# EAGLE design Alves_ADC v.1.0 (EAGLE 9.2.2)

## Sheet 1 of 6
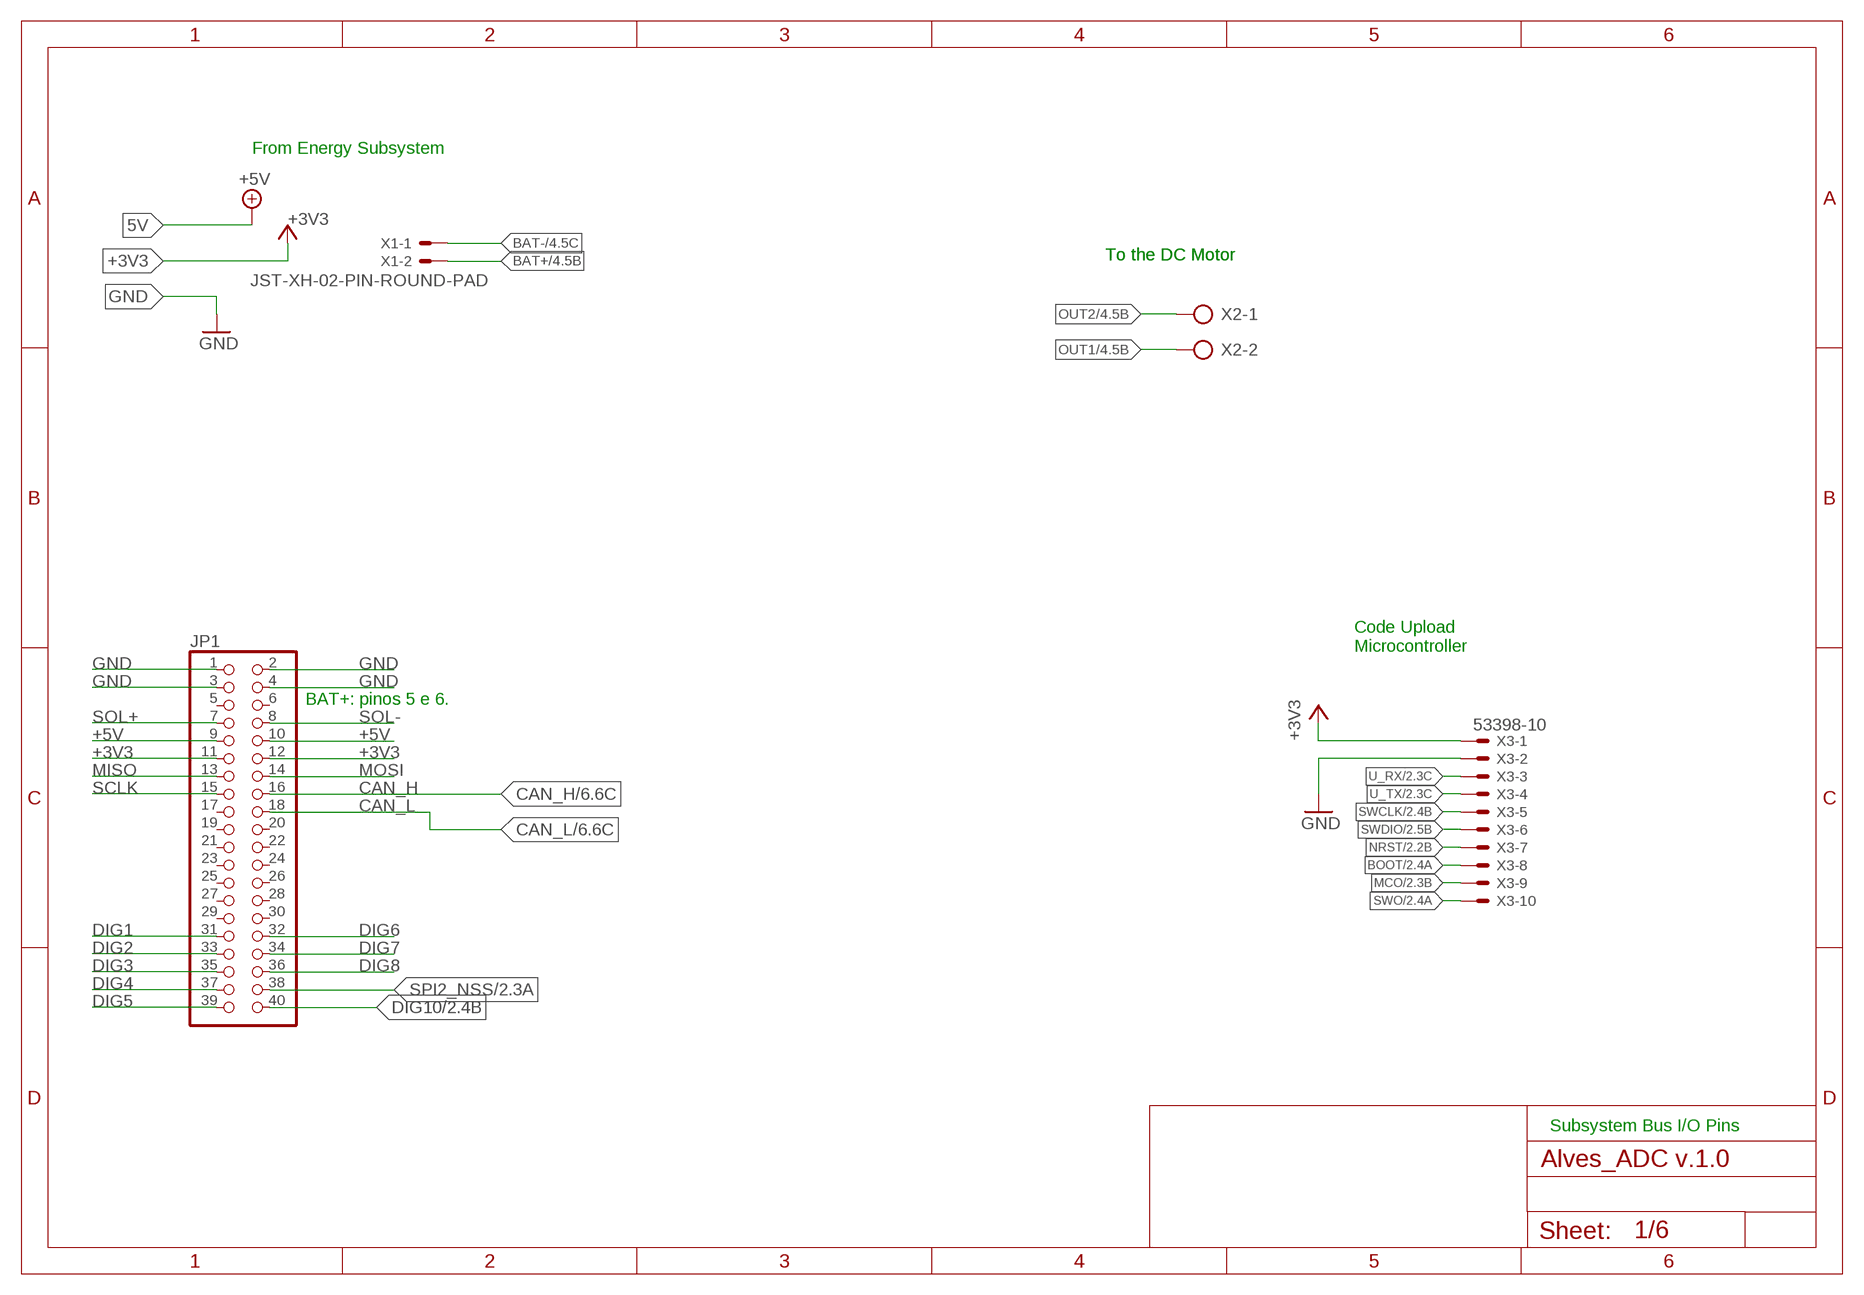
[diagram p0: schematic, sheet 1]

### Parts
JP1  PINHD-2X20  [2X20]
X1  JST-XH-02-PIN-ROUND-PAD  [JST-XH-02-PACKAGE-ROUND-PAD]
X2  AK500/2  [AK500/2]
X3  53398-10  [53398-10]

### Nets
+3V3: JP1.11 JP1.12 X3.1 ; also sheet 2,3,5,6
+5V: JP1.9 JP1.10 ; also sheet 4
BAT+: X1.2 ; also sheet 4
BAT-: X1.1 ; also sheet 4
BOOT: X3.8 ; also sheet 2
CAN_H: JP1.16 ; also sheet 6
CAN_L: JP1.18 ; also sheet 6
DIG1: JP1.31
DIG2: JP1.33
DIG3: JP1.35
DIG4: JP1.37
DIG5: JP1.39
DIG6: JP1.32
DIG7: JP1.34
DIG8: JP1.36
DIG10: JP1.40 ; also sheet 2
GND: JP1.1 JP1.2 JP1.3 JP1.4 X3.2 ; also sheet 2,3,4,5,6
MCO: X3.9 ; also sheet 2
MISO: JP1.13 ; also sheet 2
MOSI: JP1.14 ; also sheet 2
NRST: X3.7 ; also sheet 2
OUT1: X2.2 ; also sheet 4
OUT2: X2.1 ; also sheet 4
SCLK: JP1.15 ; also sheet 2
SOL+: JP1.7
SOL-: JP1.8
SPI2_NSS: JP1.38 ; also sheet 2
SWCLK: X3.5 ; also sheet 2
SWDIO: X3.6 ; also sheet 2
SWO: X3.10 ; also sheet 2
U_RX: X3.3 ; also sheet 2
U_TX: X3.4 ; also sheet 2
Unconnected: JP1.5 JP1.6 JP1.17 JP1.19 JP1.20 JP1.21 JP1.22 JP1.23 JP1.24 JP1.25 JP1.26 JP1.27 JP1.28 JP1.29 JP1.30

### Notes on the sheet
- From Energy Subsystem
- To the DC Motor | To the DC Motor
- Code Upload
  Microcontroller
- BAT+: pinos 5 e 6.
- Subsystem Bus I/O Pins

## Sheet 2 of 6
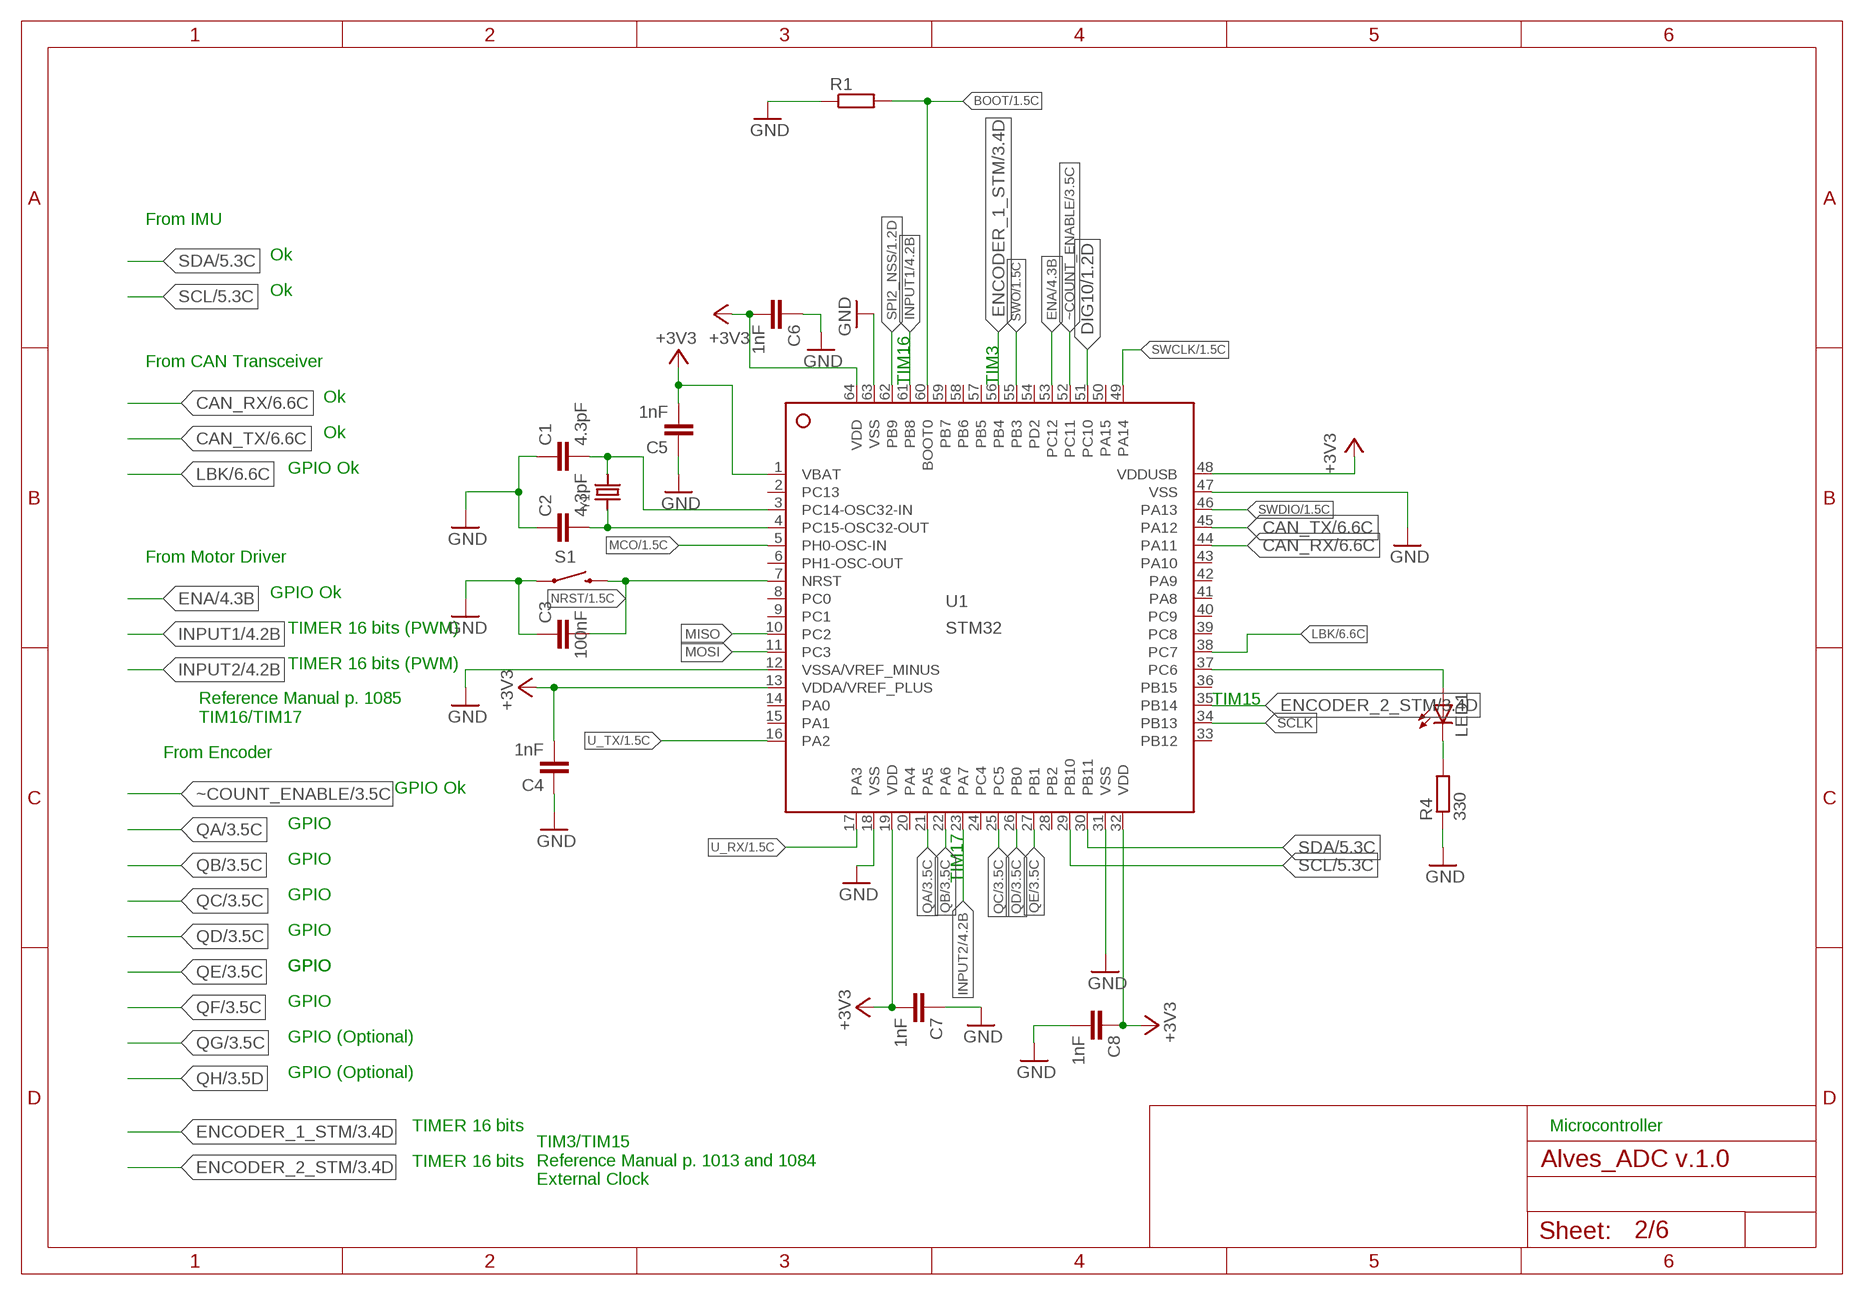
[diagram p1: schematic, sheet 2]

### Parts
C1  4.3pF  C-EUC1206  [C1206]
C2  4.3pF  C-EUC1206  [C1206]
C3  100nF  C-EUC1206  [C1206]
C4  1nF  C-EUC1206  [C1206]
C5  1nF  C-EUC1206  [C1206]
C6  1nF  C-EUC1206  [C1206]
C7  1nF  C-EUC1206  [C1206]
C8  1nF  C-EUC1206  [C1206]
LED1  LEDSMT1206  [1206]
R1  R-EU_R1206  [R1206]
R4  330  R-EU_R1206  [R1206]
S1  SWITCH-MOMENTARY-2SMD-1101NE  [TACTILE-SWITCH-1101NE]
U1  STM32  STM32L476RCT6  [LQFP64_10X10]
Y1  CRYSTAL8X3.8SMT  [CRYSTAL_8X3.8]

### Nets
+3V3: C4.2 C5.2 C6.2 C7.2 C8.1 U1.1(VBAT) U1.13(VDDA/VREF_PLUS) U1.19(VDD) U1.32(VDD) U1.48(VDDUSB) U1.64(VDD) ; also sheet 1,3,5,6
BOOT: R1.2 U1.60(BOOT0) ; also sheet 1
CAN_RX: U1.44(PA11) ; also sheet 6
CAN_TX: U1.45(PA12) ; also sheet 6
DIG10: U1.51(PC10) ; also sheet 1
ENA: U1.53(PC12) ; also sheet 4
ENCODER_1_STM: U1.56(PB4) ; also sheet 3
ENCODER_2_STM: U1.35(PB14) ; also sheet 3
GND: C1.1 C2.1 C3.1 C4.1 C5.1 C6.1 C7.1 C8.2 R1.1 R4.1 S1.1 U1.12(VSSA/VREF_MINUS) U1.18(VSS) U1.31(VSS) U1.47(VSS) U1.63(VSS) ; also sheet 1,3,4,5,6
INPUT1: U1.61(PB8) ; also sheet 4
INPUT2: U1.23(PA7) ; also sheet 4
LBK: U1.38(PC7) ; also sheet 6
MCO: U1.5(PH0-OSC-IN) ; also sheet 1
MISO: U1.10(PC2) ; also sheet 1
MOSI: U1.11(PC3) ; also sheet 1
N$1: LED1.A U1.37(PC6)
N$3: C1.2 U1.3(PC14-OSC32-IN) Y1.P$4
N$8: C2.2 U1.4(PC15-OSC32-OUT) Y1.P$1
N$10: LED1.C R4.2
NRST: C3.2 S1.2 U1.7(NRST) ; also sheet 1
QA: U1.21(PA5) ; also sheet 3
QB: U1.22(PA6) ; also sheet 3
QC: U1.25(PC5) ; also sheet 3
QD: U1.26(PB0) ; also sheet 3
QE: U1.27(PB1) ; also sheet 3
SCL: U1.29(PB10) ; also sheet 5
SCLK: U1.34(PB13) ; also sheet 1
SDA: U1.30(PB11) ; also sheet 5
SPI2_NSS: U1.62(PB9) ; also sheet 1
SWCLK: U1.49(PA14) ; also sheet 1
SWDIO: U1.46(PA13) ; also sheet 1
SWO: U1.55(PB3) ; also sheet 1
U_RX: U1.17(PA3) ; also sheet 1
U_TX: U1.16(PA2) ; also sheet 1
~COUNT_ENABLE: U1.52(PC11) ; also sheet 3
Unconnected: U1.2(PC13) U1.6(PH1-OSC-OUT) U1.8(PC0) U1.9(PC1) U1.14(PA0) U1.15(PA1) U1.20(PA4) U1.24(PC4) U1.28(PB2) U1.33(PB12) U1.36(PB15) U1.39(PC8) U1.40(PC9) U1.41(PA8) U1.42(PA9) U1.43(PA10) U1.50(PA15) U1.54(PD2) U1.57(PB5) U1.58(PB6) U1.59(PB7)

### Notes on the sheet
- From IMU
- Ok
- Ok
- From CAN Transceiver
- TIM16 | TIM3
- Ok
- Ok
- GPIO Ok
- From Motor Driver
- GPIO Ok
- TIMER 16 bits (PWM)
- TIMER 16 bits (PWM)
- TIM15
- Reference Manual p. 1085
  TIM16/TIM17
- From Encoder
- GPIO Ok
- GPIO
- GPIO
- TIM17
- GPIO
- GPIO
- GPIO | GPIO
- GPIO
- GPIO (Optional)
- GPIO (Optional)
- TIMER 16 bits | Microcontroller
- TIMER 16 bits
- TIM3/TIM15
  Reference Manual p. 1013 and 1084
  External Clock

## Sheet 3 of 6
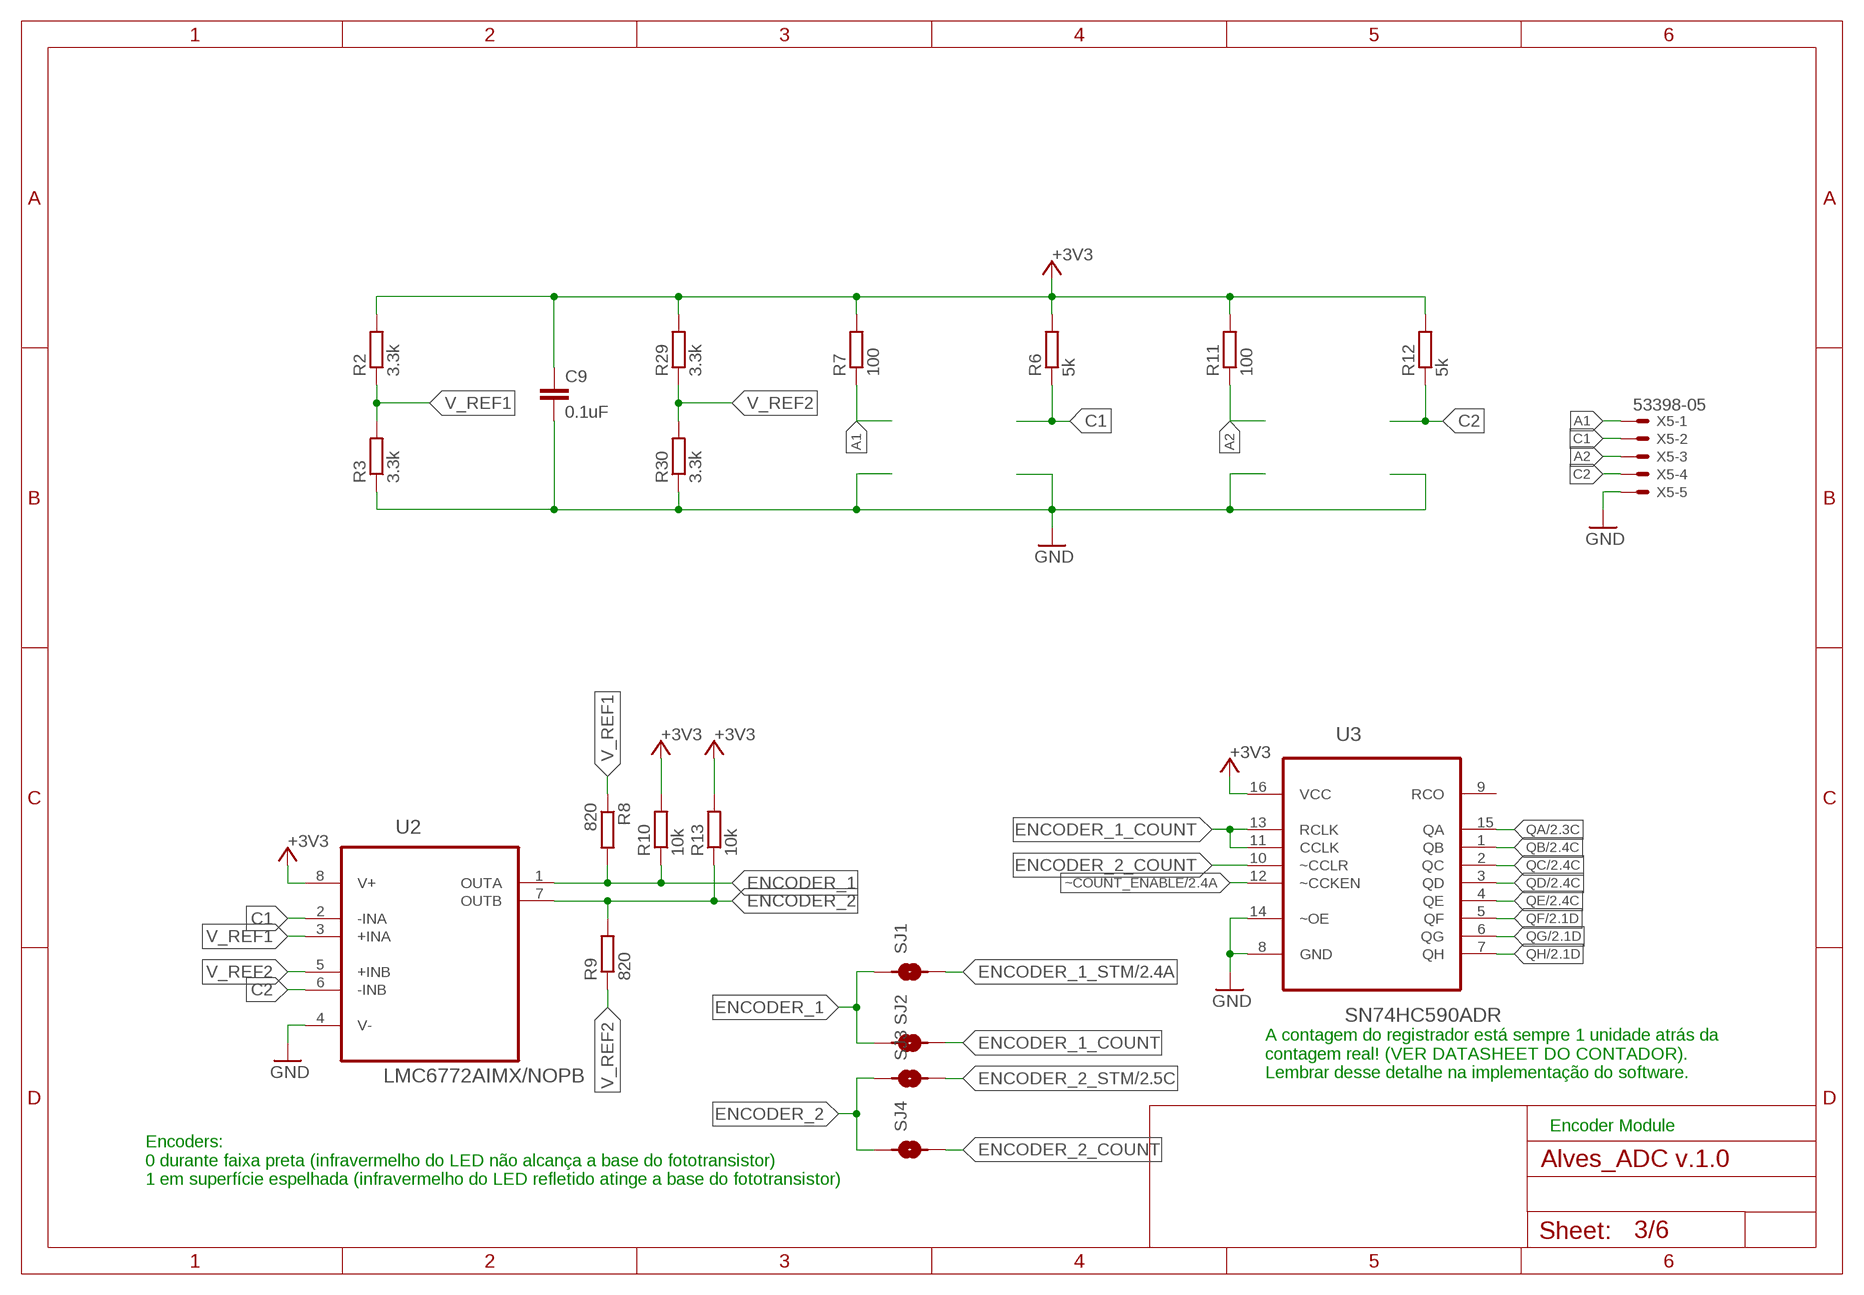
[diagram p2: schematic, sheet 3]

### Parts
C9  0.1uF  C-EUC1206  [C1206]
R2  3.3k  R-EU_R1206  [R1206]
R3  3.3k  R-EU_R1206  [R1206]
R6  5k  R-EU_R1206  [R1206]
R7  100  R-EU_R1206  [R1206]
R8  820  R-EU_R1206  [R1206]
R9  820  R-EU_R1206  [R1206]
R10  10k  R-EU_R1206  [R1206]
R11  100  R-EU_R1206  [R1206]
R12  5k  R-EU_R1206  [R1206]
R13  10k  R-EU_R1206  [R1206]
R29  3.3k  R-EU_R1206  [R1206]
R30  3.3k  R-EU_R1206  [R1206]
SJ1  SMD-JUMPER-2  [SMD-JUMPER-2]
SJ2  SMD-JUMPER-2  [SMD-JUMPER-2]
SJ3  SMD-JUMPER-2  [SMD-JUMPER-2]
SJ4  SMD-JUMPER-2  [SMD-JUMPER-2]
U2  LMC6772AIMX/NOPB  [SOIC127P600X175-8N]
U3  SN74HC590ADR  [SOIC127P600X175-16N]
X5  53398-05  [53398-05]

### Nets
+3V3: C9.1 R2.2 R6.2 R7.2 R10.2 R11.2 R12.2 R13.2 R29.2 U2.8(V+) U3.16(VCC) ; also sheet 1,2,5,6
A1: R7.1 X5.1
A2: R11.1 X5.3
C1: R6.1 U2.2(-INA) X5.2
C2: R12.1 U2.6(-INB) X5.4
ENCODER_1: R8.2 R10.1 SJ1.1 SJ2.1 U2.1(OUTA)
ENCODER_1_COUNT: SJ2.2 U3.11(CCLK) U3.13(RCLK)
ENCODER_1_STM: SJ1.2 ; also sheet 2
ENCODER_2: R9.2 R13.1 SJ3.1 SJ4.1 U2.7(OUTB)
ENCODER_2_COUNT: SJ4.2 U3.10(~CCLR)
ENCODER_2_STM: SJ3.2 ; also sheet 2
GND: C9.2 R3.1 R30.1 U2.4(V-) U3.8(GND) U3.14(~OE) X5.5 ; also sheet 1,2,4,5,6
QA: U3.15(QA) ; also sheet 2
QB: U3.1(QB) ; also sheet 2
QC: U3.2(QC) ; also sheet 2
QD: U3.3(QD) ; also sheet 2
QE: U3.4(QE) ; also sheet 2
QF: U3.5(QF) ; also sheet 2
QG: U3.6(QG) ; also sheet 2
QH: U3.7(QH) ; also sheet 2
V_REF1: R2.1 R3.2 R8.1 U2.3(+INA)
V_REF2: R9.1 R29.1 R30.2 U2.5(+INB)
~COUNT_ENABLE: U3.12(~CCKEN) ; also sheet 2
Unconnected: U3.9(RCO)

### Notes on the sheet
- A contagem do registrador está sempre 1 unidade atrás da
  contagem real! (VER DATASHEET DO CONTADOR).
  Lembrar desse detalhe na implementação do software.
- Encoder Module
- Encoders:
  0 durante faixa preta (infravermelho do LED não alcança a base do fototransistor)
  1 em superfície espelhada (infravermelho do LED refletido atinge a base do fototransistor)

## Sheet 4 of 6
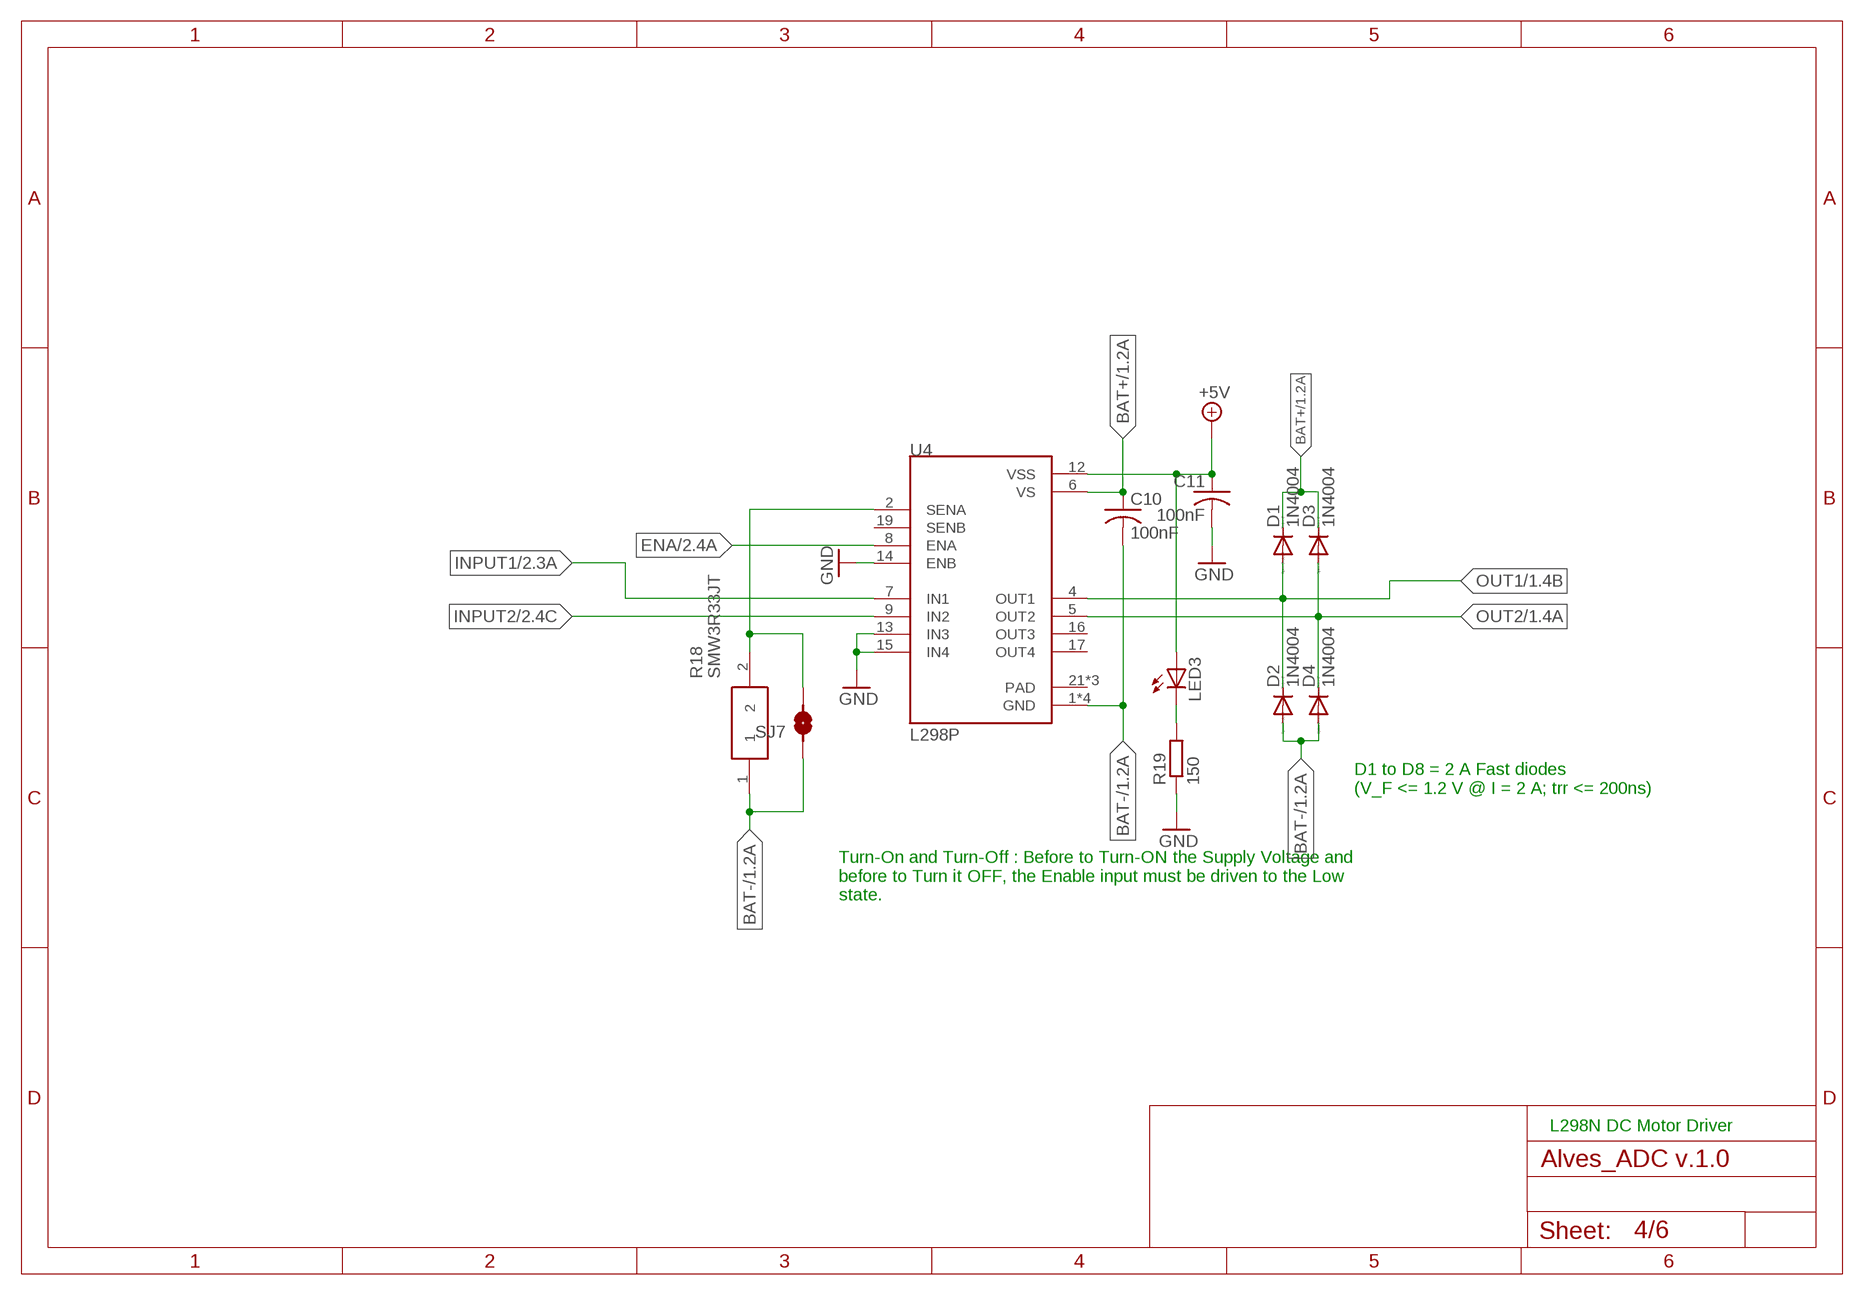
[diagram p3: schematic, sheet 4]

### Parts
C10  100nF  C-US050-024X044  [C050-024X044]
C11  100nF  C-US050-024X044  [C050-024X044]
D1  1N4004  [DO41-10]
D2  1N4004  [DO41-10]
D3  1N4004  [DO41-10]
D4  1N4004  [DO41-10]
LED3  LEDSMT1206  [1206]
R18  SMW3R33JT  [RESM12055X530N]
R19  150  R-EU_R1206  [R1206]
SJ7  SMD-JUMPER-2  [SMD-JUMPER-2]
U4  L298P  [SOIC127P1420X360-20N]

### Nets
+5V: C11.1 LED3.A U4.12(VSS) ; also sheet 1
BAT+: C10.1 D1.C D3.C U4.6(VS) ; also sheet 1
BAT-: C10.2 D2.A D4.A R18.1 SJ7.1 U4.1(GND) U4.10(GND) U4.11(GND) U4.20(GND) ; also sheet 1
ENA: U4.8(ENA) ; also sheet 2
GND: C11.2 R19.1 U4.13(IN3) U4.14(ENB) U4.15(IN4) ; also sheet 1,2,3,5,6
INPUT1: U4.7(IN1) ; also sheet 2
INPUT2: U4.9(IN2) ; also sheet 2
N$2: LED3.C R19.2
N$15: R18.2 SJ7.2 U4.2(SENA)
OUT1: D1.A D2.C U4.4(OUT1) ; also sheet 1
OUT2: D3.A D4.C U4.5(OUT2) ; also sheet 1
Unconnected: U4.16(OUT3) U4.17(OUT4) U4.19(SENB) U4.21(PAD) U4.22(PAD) U4.23(PAD)

### Notes on the sheet
- D1 to D8 = 2 A Fast diodes
  (V_F <= 1.2 V @ I = 2 A; trr <= 200ns)
- Turn-On and Turn-Off : Before to Turn-ON the Supply Voltage and
  before to Turn it OFF, the Enable input must be driven to the Low
  state.
- L298N DC Motor Driver

## Sheet 5 of 6
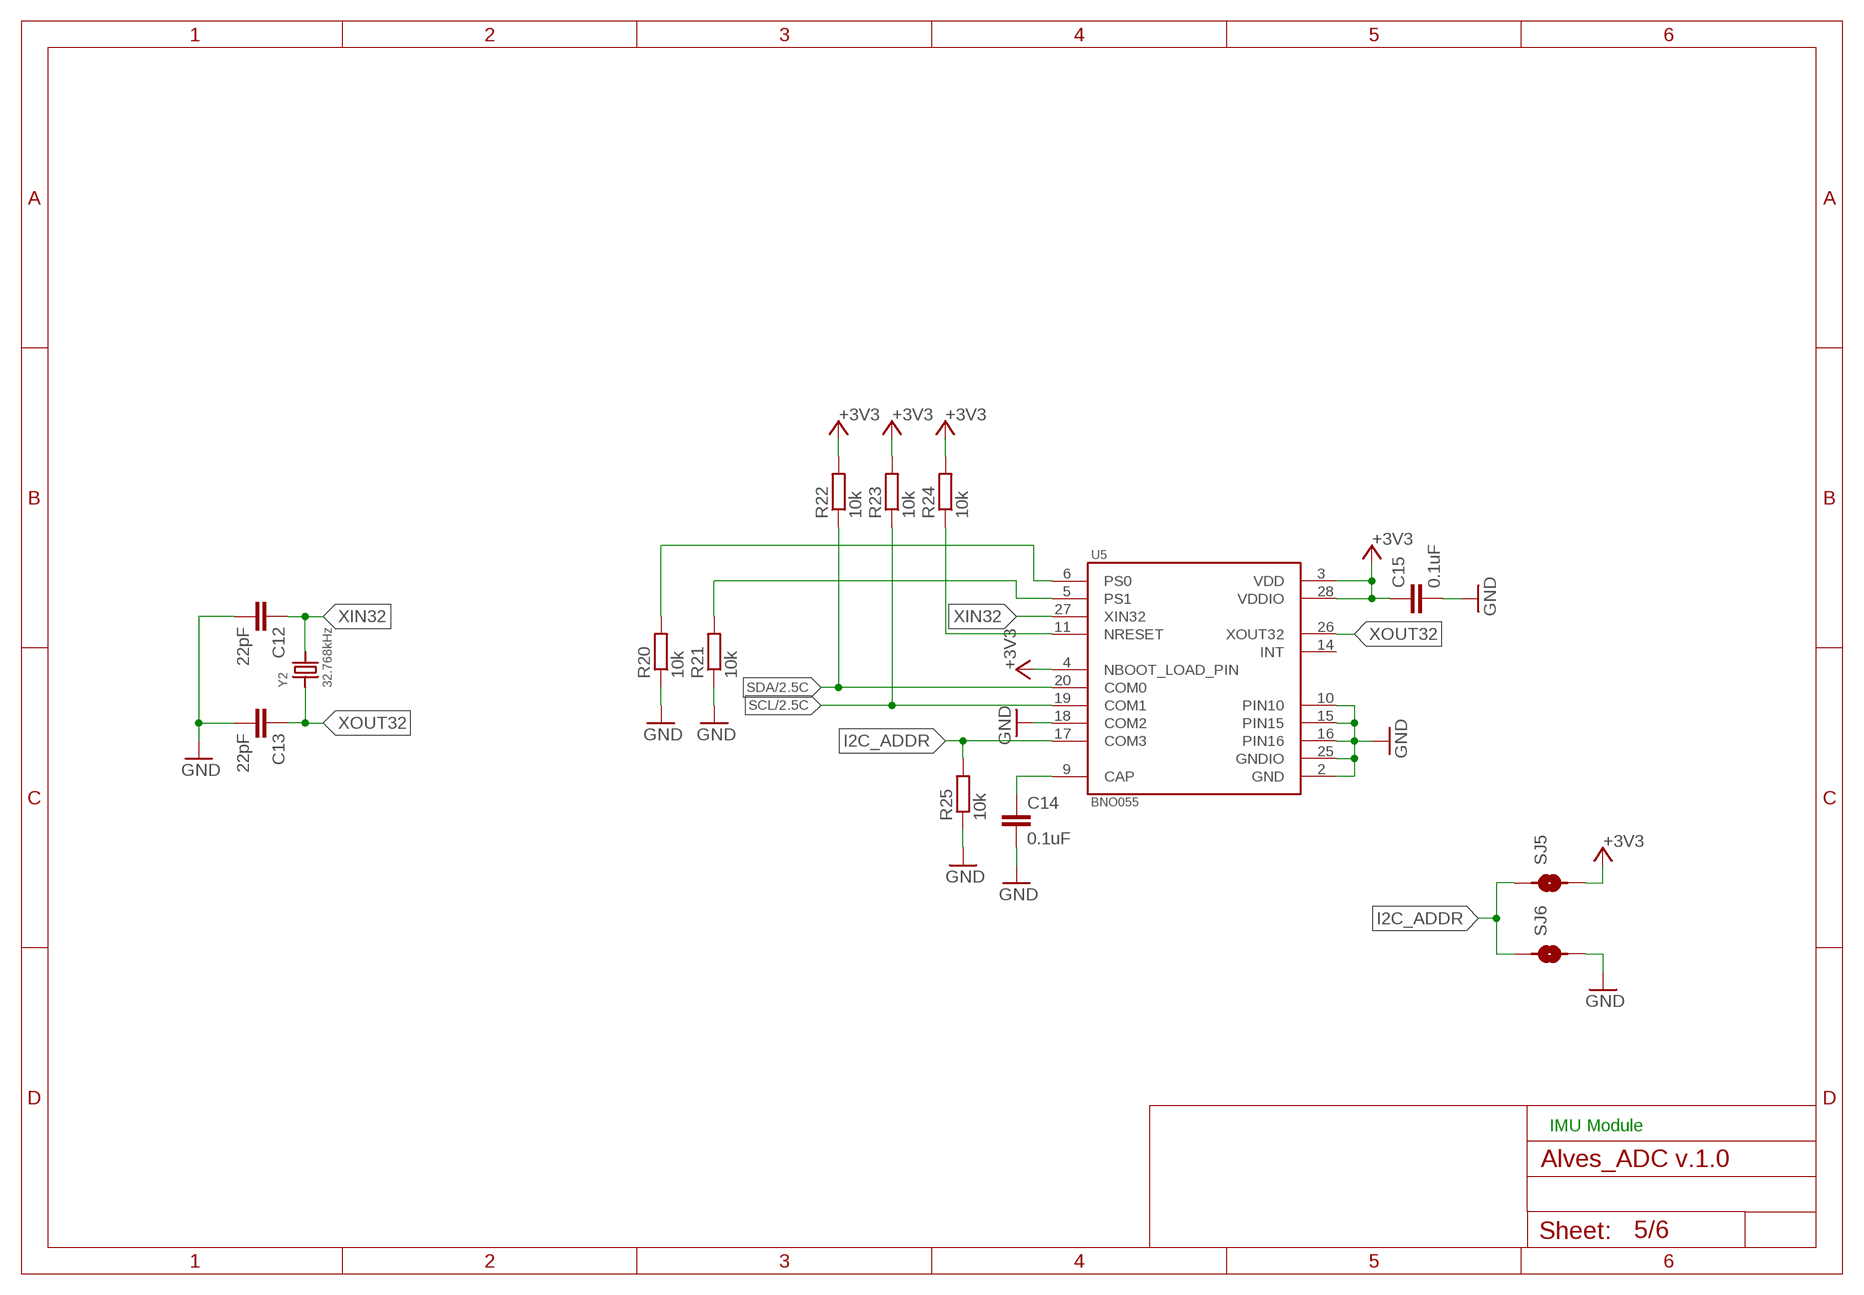
[diagram p4: schematic, sheet 5]

### Parts
C12  22pF  C-EUC1206  [C1206]
C13  22pF  C-EUC1206  [C1206]
C14  0.1uF  C-EUC1206  [C1206]
C15  0.1uF  C-EUC1206  [C1206]
R20  10k  R-EU_R1206  [R1206]
R21  10k  R-EU_R1206  [R1206]
R22  10k  R-EU_R1206  [R1206]
R23  10k  R-EU_R1206  [R1206]
R24  10k  R-EU_R1206  [R1206]
R25  10k  R-EU_R1206  [R1206]
SJ5  SMD-JUMPER-2  [SMD-JUMPER-2]
SJ6  SMD-JUMPER-2  [SMD-JUMPER-2]
U5  BNO055  [LGA28R50P4X10_380X520X100]
Y2  32.768kHz  CRYSTAL8X3.8SMT  [CRYSTAL_8X3.8]

### Nets
+3V3: C15.1 R22.2 R23.2 R24.2 SJ5.2 U5.3(VDD) U5.4(NBOOT_LOAD_PIN) U5.28(VDDIO) ; also sheet 1,2,3,6
GND: C12.2 C13.2 C14.2 C15.2 R20.1 R21.1 R25.1 SJ6.2 U5.2(GND) U5.10(PIN10) U5.15(PIN15) U5.16(PIN16) U5.18(COM2) U5.25(GNDIO) ; also sheet 1,2,3,4,6
I2C_ADDR: R25.2 SJ5.1 SJ6.1 U5.17(COM3)
N$4: C14.1 U5.9(CAP)
NRESET: R24.1 U5.11(NRESET)
PS0: R20.2 U5.6(PS0)
PS1: R21.2 U5.5(PS1)
SCL: R23.1 U5.19(COM1) ; also sheet 2
SDA: R22.1 U5.20(COM0) ; also sheet 2
XIN32: C12.1 U5.27(XIN32) Y2.P$4
XOUT32: C13.1 U5.26(XOUT32) Y2.P$1
Unconnected: U5.14(INT)

### Notes on the sheet
- IMU Module

## Sheet 6 of 6
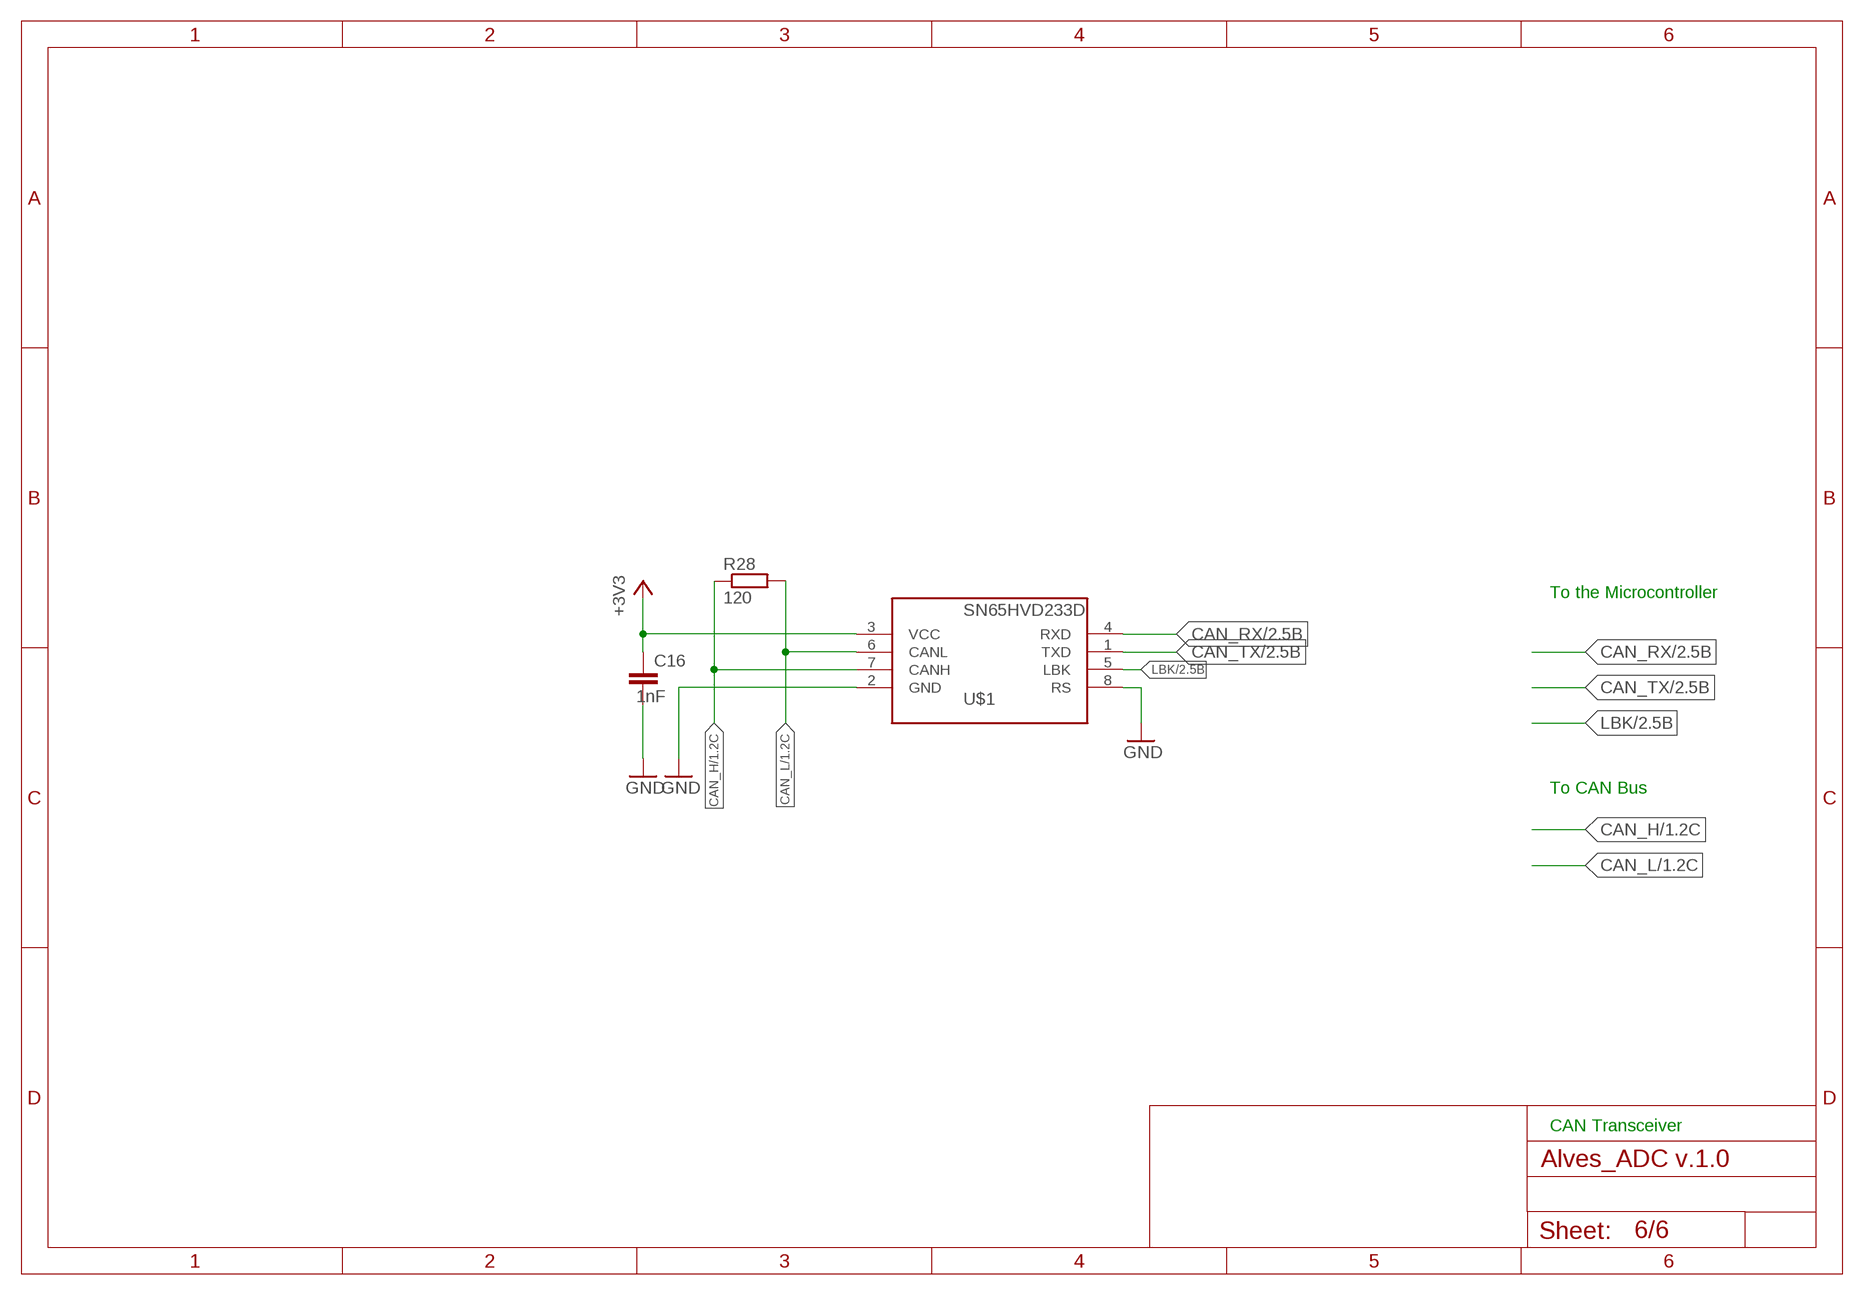
[diagram p5: schematic, sheet 6]

### Parts
C16  1nF  C-EUC1206  [C1206]
R28  120  R-EU_R1206  [R1206]
U$1  SN65HVD233D  [SOIC8]

### Nets
+3V3: C16.1 U$1.3(VCC) ; also sheet 1,2,3,5
CAN_H: R28.1 U$1.7(CANH) ; also sheet 1
CAN_L: R28.2 U$1.6(CANL) ; also sheet 1
CAN_RX: U$1.4(RXD) ; also sheet 2
CAN_TX: U$1.1(TXD) ; also sheet 2
GND: C16.2 U$1.2(GND) U$1.8(RS) ; also sheet 1,2,3,4,5
LBK: U$1.5(LBK) ; also sheet 2

### Notes on the sheet
- To the Microcontroller
- To CAN Bus
- CAN Transceiver

## Library data of the parts
C1-C9 C12-C16 = rcl:C-EU: CAPACITOR, European symbol; SPICEPREFIX: C
C10 C11 = rcl:C-US: CAPACITOR, American symbol
D1-D4 = diode:1N4004: DIODE general purpose rectifier, 1 A
JP1 = pinhead:PINHD-2X20: PIN HEADER
LED1 LED3 = led:LED: LED OSRAM: - CHIPLED LG R971, LG N971, LY N971, LG Q971, LY Q971, LO R971, LY R971 LH N974, LH R974 LS Q976, LO Q976, LY Q976 LO Q996 - Hyper CHIPLED LW Q18S LB Q993, LB Q99A, LB R99A - SideLED LS A670, LO A670, LY A670, LG A670, LP A670 LB A673, LV A673, LT A673, LW A673 LH A674 LY A675 LS A676, LA A676, LO A676, LY A676, LW A676 LS A679, LY A679, LG A679 - Hyper Micro SIDELED® LS Y876, LA Y876, LO Y876, LY Y876 LT Y87S - SmartLED LW L88C, LW L88S LB L89C, LB L89S, LG L890 LS L89K, LO L89K, LY L89K LS L896, LA L896, LO L896, LY L896 - TOPLED LS T670, LO T670, LY T670, LG T670, LP T670 LSG T670, LSP T670, LSY T670, LOP T670, LYG T670 LG T671, LOG T671, LSG T671 LB T673, LV T673, LT T673, LW T673 LH T674 LS T676, LA T676, LO T676, LY T676, LB T676, LH T676, LSB T676, LW T676 LB T67C, LV T67C, LT T67C, LS T67K, LO T67K, LY T67K, LW E67C LS E67B, LA E67B, LO E67B, LY E67B, LB E67C, LV E67C, LT E67C LW T67C LS T679, LY T679, LG T679 LS T770, LO T770, LY T770, LG T770, LP T770 LB T773, LV T773, LT T773, LW T773 LH T774 LS E675, LA E675, LY E675, LS T675 LS T776, LA T776, LO T776, LY T776, LB T776 LHGB T686 LT T68C, LB T68C - Hyper Mini TOPLED® LB M676 - Mini TOPLED Santana® LG M470 LS M47K, LO M47K, LY M47K Source: http://www.osram.convergy.de LUXEON: - LUMILED® LXK2-PW12-R00, LXK2-PW12-S00, LXK2-PW14-U00, LXK2-PW14-V00 LXK2-PM12-R00, LXK2-PM12-S00, LXK2-PM14-U00 LXK2-PE12-Q00, LXK2-PE12-R00, LXK2-PE12-S00, LXK2-PE14-T00, LXK2-PE14-U00 LXK2-PB12-K00, LXK2-PB12-L00, LXK2-PB12-M00, LXK2-PB14-N00, LXK2-PB14-P00, LXK2-PB14-Q00 LXK2-PR12-L00, LXK2-PR12-M00, LXK2-PR14-Q00, LXK2-PR14-R00 LXK2-PD12-Q00, LXK2-PD12-R00, LXK2-PD12-S00 LXK2-PH12-R00, LXK2-PH12-S00 LXK2-PL12-P00, LXK2-PL12-Q00, LXK2-PL12-R00 Source: www.luxeon.com KINGBRIGHT: KA-3528ASYC Source: www.kingbright.com
R1-R4 R6-R13 R19-R25 R28-R30 = rcl:R-EU_: RESISTOR, European symbol; SPICEPREFIX: R
R18 = SMW3R33JT:SMW3R33JT: TE Connectivity SMW Series Wire Wound High Power Surface Mount Resistor 330m +/-5% 3W +/-200ppm/C Source: Datasheet <http://docs-emea.rs-online.com/webdocs/087d/0900766b8087d7f5.pdf>; ALLIED_NUMBER: 70064315; ALLIED_PRICE-STOCK: https://www.alliedelec.com/te-connectivity-smw3r33jt/70064315/; DESCRIPTION: TE Connectivity SMW Series Wire Wound High Power Surface Mount Resistor 330m +/-5% 3W +/-200ppm/C; HEIGHT: 5.3mm; MANUFACTURER_NAME: TE Connectivity; MANUFACTURER_PART_NUMBER: SMW3R33JT; MOUSER_PART_NUMBER: 571-SMW3R33JT; MOUSER_PRICE-STOCK: https://www.mouser.com/Search/Refine.aspx?Keyword=571-SMW3R33JT; RS_PART_NUMBER: 6475977; RS_PRICE-STOCK: https://uk.rs-online.com/web/p/products/6475977
S1 = SparkFun-Electromechanical:SWITCH-MOMENTARY-2: Various NO switches- pushbuttons, reed, etc; PROD_ID: SWCH-00815
SJ1-SJ7 = FaBo-etc:SMD-JUMPER-2
U1 = STM32L4xxx:STM32L476R*: STM32L476RX LQFP100 Datasheet STM32L476XX <http://www.st.com/content/ccc/resource/technical/document/datasheet/c5/ed/2f/60/aa/79/42/0b/DM00108832.pdf/files/DM00108832.pdf/jcr:content/translations/en.DM00108832.pdf>; FARNELL: 2518170; FLASH: 256kB; SRAM: 128kB
U2 = LMC6772AIMX_NOPB:LMC6772AIMX/NOPB: CMOS Comparator; DESCRIPTION: Dual MicroPower ail-to- ail Input CMOS Comparator with Open Drain Output 8-SOIC -40 to 85; DIGI-KEY_PART_NUMBER: LMC6772AIMX/NOPBCT-ND; DIGI-KEY_PURCHASE_URL: https://www.digikey.com.br/product-detail/en/texas-instruments/LMC6772AIMX-NOPB/LMC6772AIMX-NOPBCT-ND/3527055?utm_source=snapeda&utm_medium=aggregator&utm_campaign=symbol; MF: Texas Instruments; MP: LMC6772AIMX/NOPB; PACKAGE: SOIC-8 Texas Instruments
U3 = SN74HC590ADR:SN74HC590ADR: 8 Bit Binary Counters; AVAILABILITY: Unavailable; DESCRIPTION: 8-Bit Binary Counters With 3-State Output Registers 16-SOIC -40 to 85; MF: Texas Instruments; MP: SN74HC590ADR; PACKAGE: SOIC-16 Texas Instruments; PRICE: None
U4 = L298P:L298P: L298 Series Dual Full Bridge 4 A 46 V Driver Surface Mount - PowerSO-20; DESCRIPTION: L298 Series Dual Full Bridge 4 A 46 V Driver Surface Mount - PowerSO-20; DIGI-KEY_PART_NUMBER: 497-1396-5-ND; DIGI-KEY_PURCHASE_URL: https://www.digikey.com.br/product-detail/en/stmicroelectronics/L298P/497-1396-5-ND/585919?utm_source=snapeda&utm_medium=aggregator&utm_campaign=symbol; MF: STMicroelectronics; MP: L298P; PACKAGE: SO-20 STMicroelectronics
U5 = BNO055:BNO055: BNO055 9-axis Absolute Orientation Sensor ( SiP ) w/Sensors and Sensor Fusion; DESCRIPTION: BNO055 9-axis Absolute Orientation Sensor _ SiP _ w/Sensors and Sensor Fusion; DIGI-KEY_PART_NUMBER: 828-1058-1-ND; DIGI-KEY_PURCHASE_URL: https://www.digikey.com/product-detail/en/bosch-sensortec/BNO055/828-1058-1-ND/6136309?utm_source=snapeda&utm_medium=aggregator&utm_campaign=symbol; MF: Bosch; MP: BNO055; PACKAGE: LGA-28 Bosch
U$1 = SN65HVD233D:SN65HVD233D; AVAILABILITY: Unavailable; DESCRIPTION: 3.3V CAN Transceiver with Standby Mode, Loop-back 8-SOIC -40 to 125; MF: Texas Instruments; MP: SN65HVD233D; PACKAGE: SOIC-8 Texas Instruments; PRICE: None
X1 = Rembrandt Electronics - JST XH Connectors v1-0:JST-XH-02-PIN: JST XH Connector 2 Pin Wire to board connector. Pitch: 2,54 mm, (0.100") Number of pins: 2 Created by Rembrandt Electronics www.rembrandtelectronics.com
X2 = con-ptr500:AK500/2: CONNECTOR; OC_FARNELL: unknown; OC_NEWARK: unknown
X3 = con-molex:53?-10: CONNECTOR wire to board 1.25 mm (.049 inch) pitch header; MF: MOLEX; MPN: 53398-1071; OC_FARNELL: unknown; OC_NEWARK: 59J0425
X5 = con-molex:53?-05: CONNECTOR wire to board 1.25 mm (.049 inch) pitch header; MF: MOLEX; OC_FARNELL: 1125354; OC_NEWARK: unknown
Y1 Y2 = microbuilder:CRYSTAL: Crystals HC49UP - Surface Mount Crystal 4.0MHz 18pF +/-30ppm Surface Mount Crystal [Digikey: 535-9857-1-ND] 12.0 MHz Surface Mount Crystal [Digikey: 535-9869-6-ND] 25.0 MHz Surface Mount Crystal [Digikey: 535-9078-1-ND] 2.5 x 2.0mm - MEMs SMT Crystal 16.0 MHz 10pF 20ppm 2.5 x 2.0mm Crystal [Digikey -40-85°C: 535-10923-1-ND] 3.2 x 2.5mm - MEMs SMT Crystal 12.0 MHz 8pF 15ppm 3.2 x 2.5mm Crystal [Digikey: -10-70°C: 644-1047-1-ND -40-125°C: 644-1128-1-ND] 16.0 MHz 8pF 15ppm 3.2 x 2.5mm Crystal [Digikey: -10-70°C: 644-1049-1-ND -40-125°C: 644-1129-2-ND] 16.0 MHz 10pF 10ppm 3.2 x 2.5mm Crystal [Digikey: 644-1100-1-ND] 27.12 MHz 18pF 30ppm 3.2 x 2.5mm Crystal [Digikey: 887-1424-1-ND] 27.12MHz 10pF 10ppm 3.2 x 2.5mm Crystal [Digikey: 887-1329-1-ND] 4.9 x 1.8mm - MEMs SMT Crystal 32.768 KHz 12.5pF 20ppm 4.9 x 1.8mm Crystal [Digikey: SE2415CT-ND] 8.0 x 3.8mm - Surface Mount Crystal 32.768kHz 12.5pF 20ppm -40°C-85°C [Digikey: 535-9166-2-ND] Cylinder 32.768KHz Cylinder Crystal (2x6mm body) [Ex. Digikey: 300-8341-2-ND]

## Board
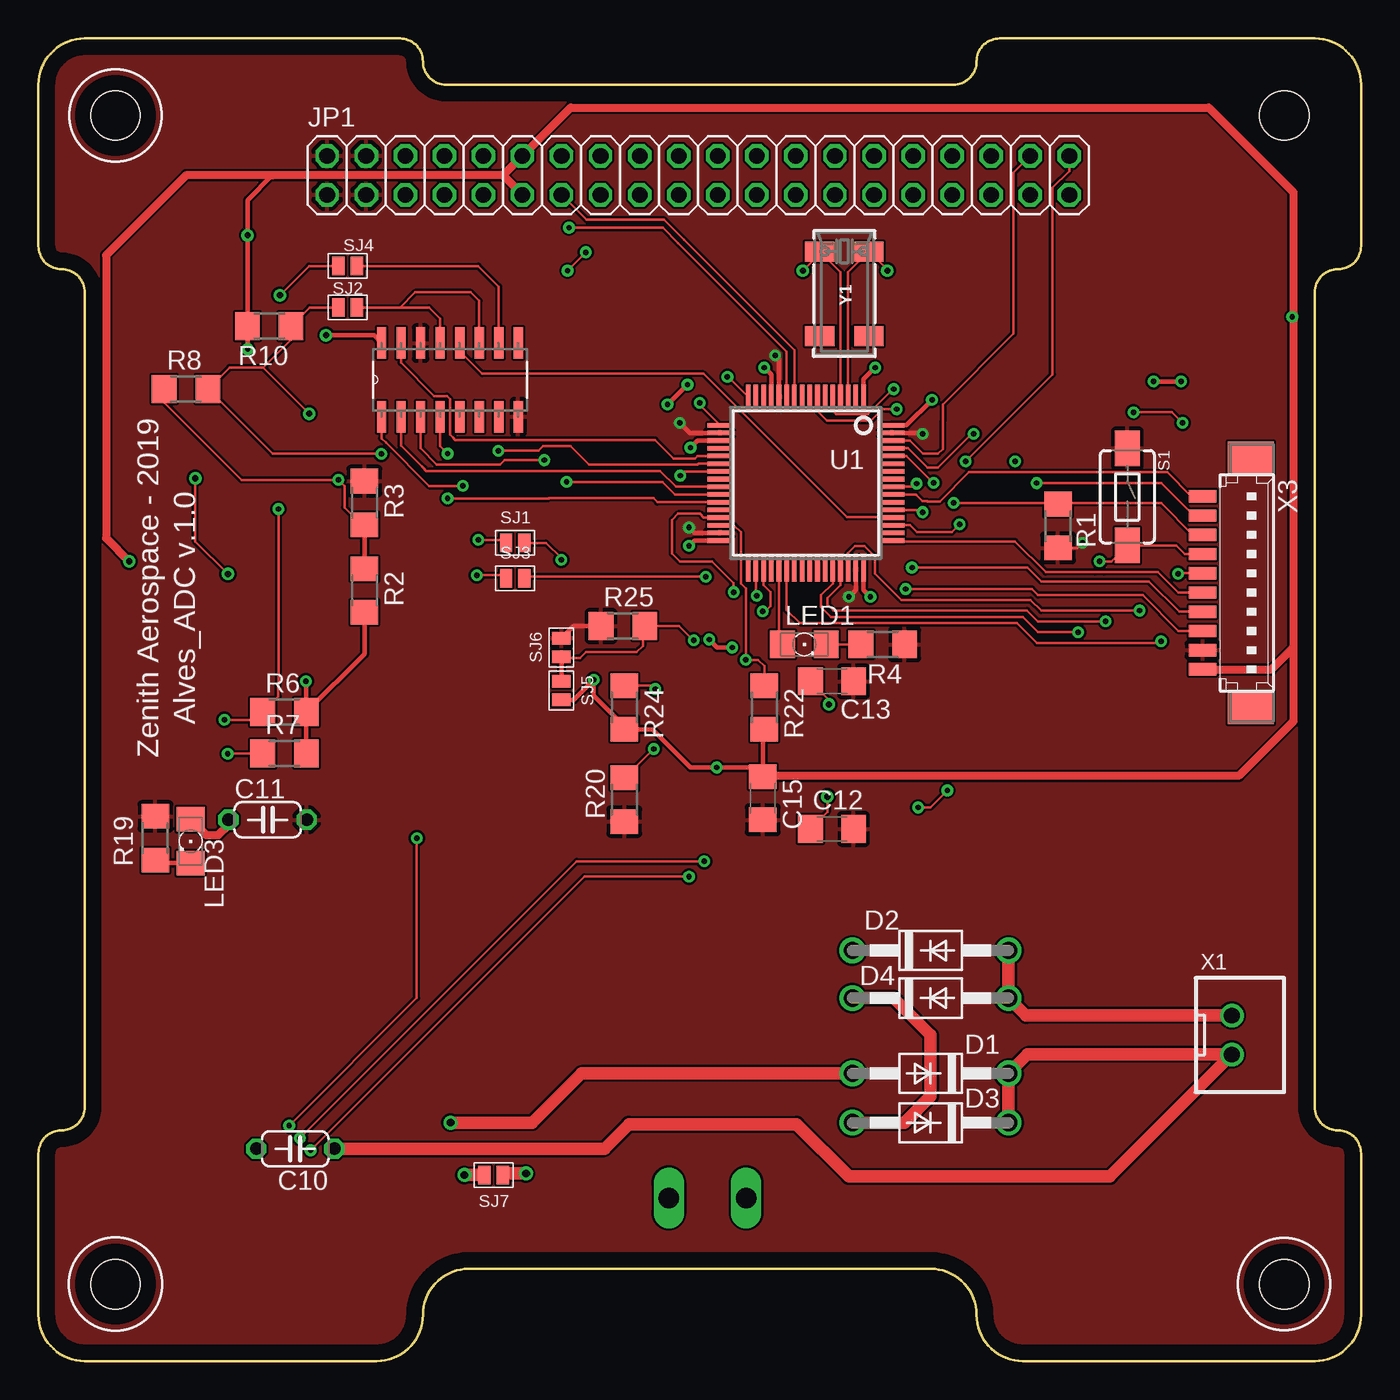
[diagram p6: board, top side]
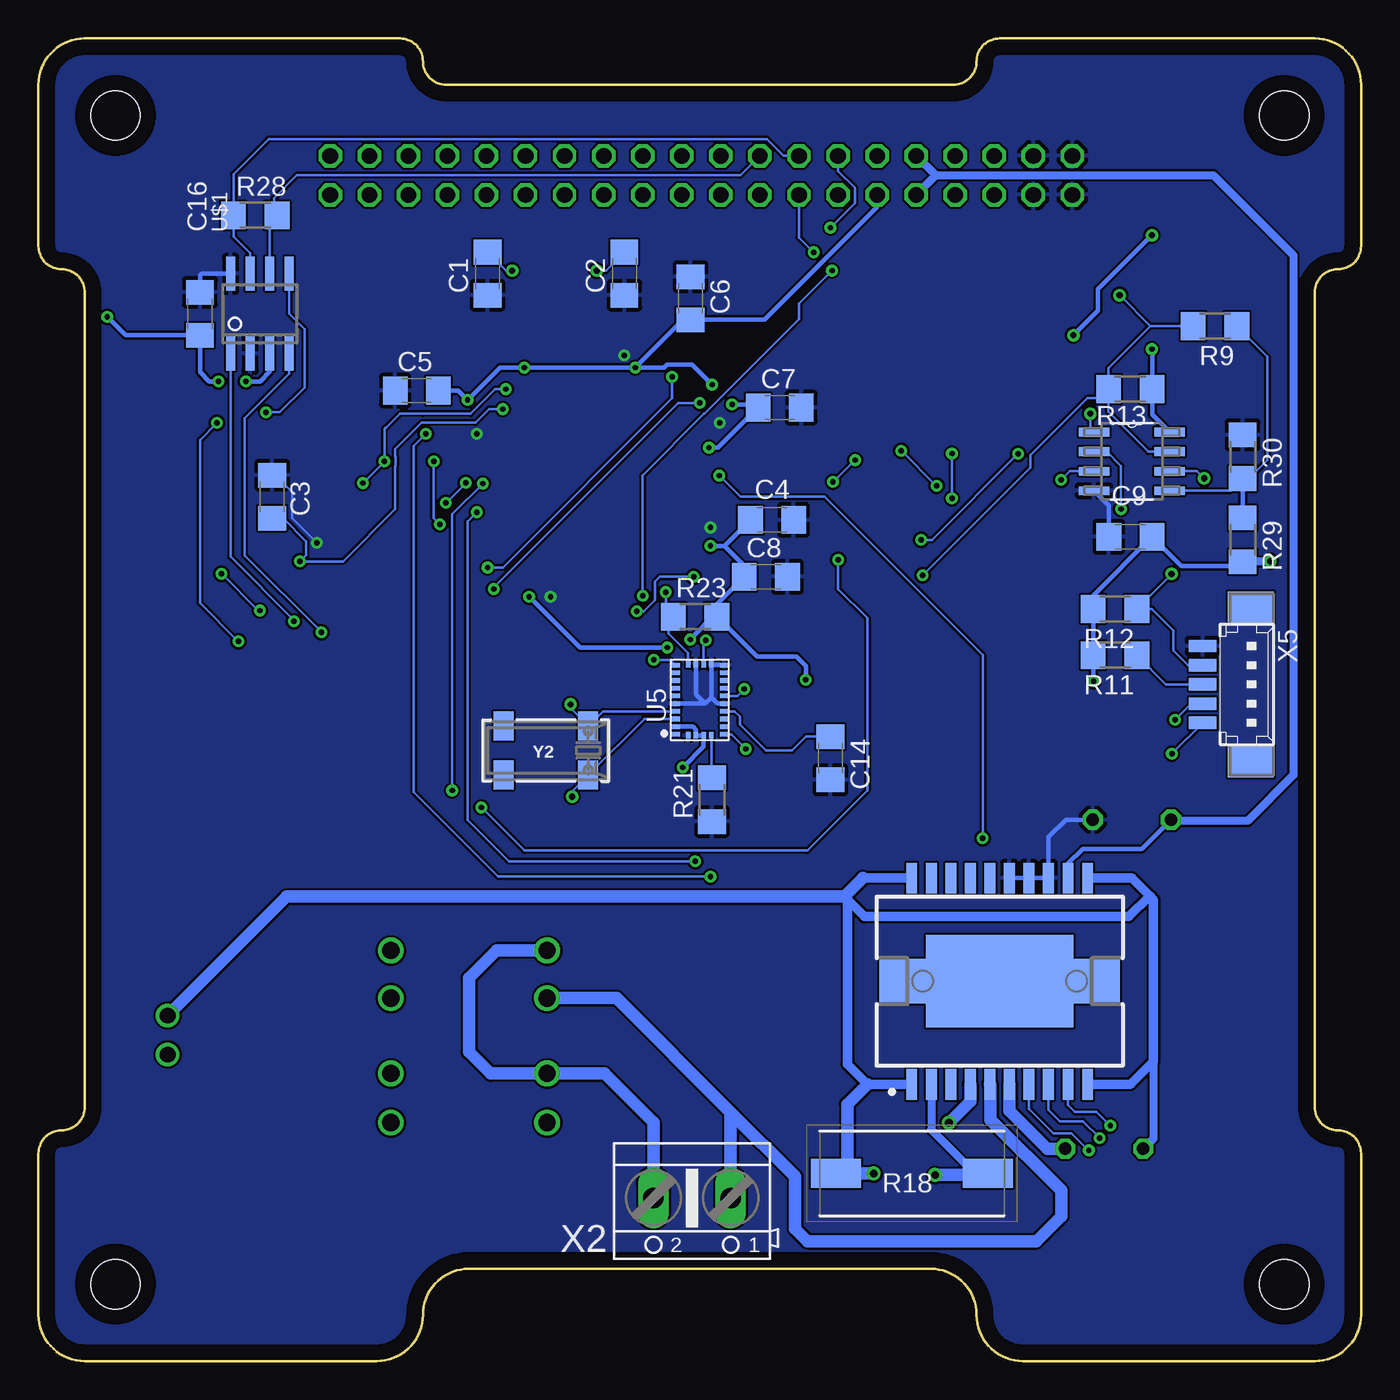
[diagram p7: board, bottom side, seen from below]

Size 86 x 86 mm. Coordinates in mm from the lower left corner, seen from the top.
Outline: 0,83 0,72.5 arc90 1.5,71 arc-90 3,69.5 3,16.5 arc-90 1.5,15 arc90 0,13.5 0,3 arc90 3,0 22,0 arc90 25,3 arc-90 28,6 58,6 arc-90 61,3 arc90 64,0 83,0 arc90 86,3 86,13.5 arc90 84.5,15 arc-90 83,16.5 83,69.5 arc-90 84.5,71 arc90 86,72.5 86,83 arc90 83,86 62.5,86 arc90 61,84.5 arc-90 59.5,83 26.5,83 arc-90 25,84.5 arc90 23.5,86 3,86 arc90 0,83
Copper layers (1*16): Top 0.035mm / dielectric 1.5mm / Bottom 0.035mm
Design rules "default *": minimum track width 6mil, minimum drill 0.35mm, track to track 6mil, track to pad 6mil, pad to pad 6mil, via to via 6mil, smd to smd 6mil, copper to edge 40mil, drill to drill 6mil, minimum pad ring 10mil, minimum via ring 8mil, stop-mask expansion 4mil, vias tented up to drill 0mil, thermal gap 10mil
Holes 3.2 mm at 5,5 81,5 81,81 5,81

### Footprints (pad centres in the part's own frame; a part is rotated, then mirrored left to right if it is on the bottom)
C1206 = smd 1.6 x 1.8: 1 -1.4,0; 2 1.4,0
C050-024X044 = drill 0.813 octagon: 1 -2.54,0; 2 2.54,0
DO41-10 = drill 1.118: A 5.08,0; C -5.08,0
2X20 = drill 1.016 octagon: 1 -24.13,-1.27; 2 -24.13,1.27; 3 -21.59,-1.27; 4 -21.59,1.27; 5 -19.05,-1.27; 6 -19.05,1.27; 7 -16.51,-1.27; 8 -16.51,1.27; 9 -13.97,-1.27; 10 -13.97,1.27; 11 -11.43,-1.27; 12 -11.43,1.27; 13 -8.89,-1.27; 14 -8.89,1.27; 15 -6.35,-1.27; 16 -6.35,1.27; 17 -3.81,-1.27; 18 -3.81,1.27; 19 -1.27,-1.27; 20 -1.27,1.27; 21 1.27,-1.27; 22 1.27,1.27; 23 3.81,-1.27; 24 3.81,1.27; 25 6.35,-1.27; 26 6.35,1.27; 27 8.89,-1.27; 28 8.89,1.27; 29 11.43,-1.27; 30 11.43,1.27; 31 13.97,-1.27; 32 13.97,1.27; 33 16.51,-1.27; 34 16.51,1.27; 35 19.05,-1.27; 36 19.05,1.27; 37 21.59,-1.27; 38 21.59,1.27; 39 24.13,-1.27; 40 24.13,1.27
1206 = smd 1.6 x 1.803: A -1.422,0; C 1.422,0
R1206 = smd 1.6 x 1.803: 1 -1.422,0; 2 1.422,0
RESM12055X530N = smd 3.25 x 1.9: 1 -4.95,0; 2 4.95,0
TACTILE-SWITCH-1101NE = smd 2.3 x 1.6: 1 -3.15,0; 2 3.15,0
SMD-JUMPER-2 = smd 0.8 x 1.2: 1 -0.6,0; 2 0.6,0
LQFP64_10X10 = smd 0.3 x 1.6: 1 -3.75,-5.6; 2 -3.25,-5.6; 3 -2.75,-5.6; 4 -2.25,-5.6; 5 -1.75,-5.6; 6 -1.25,-5.6; 7 -0.75,-5.6; 8 -0.25,-5.6; 9 0.25,-5.6; 10 0.75,-5.6; 11 1.25,-5.6; 12 1.75,-5.6; 13 2.25,-5.6; 14 2.75,-5.6; 15 3.25,-5.6; 16 3.75,-5.6; 33 3.75,5.6; 34 3.25,5.6; 35 2.75,5.6; 36 2.25,5.6; 37 1.75,5.6; 38 1.25,5.6; 39 0.75,5.6; 40 0.25,5.6; 41 -0.25,5.6; 42 -0.75,5.6; 43 -1.25,5.6; 44 -1.75,5.6; 45 -2.25,5.6; 46 -2.75,5.6; 47 -3.25,5.6; 48 -3.75,5.6 | smd 1.6 x 0.3: 17 5.6,-3.75; 18 5.6,-3.25; 19 5.6,-2.75; 20 5.6,-2.25; 21 5.6,-1.75; 22 5.6,-1.25; 23 5.6,-0.75; 24 5.6,-0.25; 25 5.6,0.25; 26 5.6,0.75; 27 5.6,1.25; 28 5.6,1.75; 29 5.6,2.25; 30 5.6,2.75; 31 5.6,3.25; 32 5.6,3.75; 49 -5.6,3.75; 50 -5.6,3.25; 51 -5.6,2.75; 52 -5.6,2.25; 53 -5.6,1.75; 54 -5.6,1.25; 55 -5.6,0.75; 56 -5.6,0.25; 57 -5.6,-0.25; 58 -5.6,-0.75; 59 -5.6,-1.25; 60 -5.6,-1.75; 61 -5.6,-2.25; 62 -5.6,-2.75; 63 -5.6,-3.25; 64 -5.6,-3.75
SOIC127P600X175-8N = smd 1.981 x 0.559: 1 -2.464,1.905; 2 -2.464,0.635; 3 -2.464,-0.635; 4 -2.464,-1.905; 5 2.464,-1.905; 6 2.464,-0.635; 7 2.464,0.635; 8 2.464,1.905
SOIC127P600X175-16N = smd 2.057 x 0.61: 1 -4.801,8.89; 2 -4.801,7.62; 3 -4.801,6.35; 4 -4.801,5.08; 5 -4.801,3.81; 6 -4.801,2.54; 7 -4.801,1.27; 8 -4.801,0; 9 0,0; 10 0,1.27; 11 0,2.54; 12 0,3.81; 13 0,5.08; 14 0,6.35; 15 0,7.62; 16 0,8.89
SOIC127P1420X360-20N = smd 2 x 0.7: 1 -6.7,5.715; 2 -6.7,4.445; 3 -6.7,3.175; 4 -6.7,1.905; 5 -6.7,0.635; 6 -6.7,-0.635; 7 -6.7,-1.905; 8 -6.7,-3.175; 9 -6.7,-4.445; 10 -6.7,-5.715; 11 6.7,-5.715; 12 6.7,-4.445; 13 6.7,-3.175; 14 6.7,-1.905; 15 6.7,-0.635; 16 6.7,0.635; 17 6.7,1.905; 18 6.7,3.175; 19 6.7,4.445; 20 6.7,5.715 | smd 6 x 9.6: 21 0,0 | smd 2.9 x 3.05: 22 0,6.3; 23 0,-6.3
LGA28R50P4X10_380X520X100 = smd 0.3 x 0.525: 1 -2.25,1.562; 6 -2.25,-1.562; 7 -1.75,-1.562; 8 -1.25,-1.562; 9 -0.75,-1.562; 10 -0.25,-1.562; 11 0.25,-1.562; 12 0.75,-1.562; 13 1.25,-1.562; 14 1.75,-1.562; 15 2.25,-1.562; 20 2.25,1.562; 21 1.75,1.562; 22 1.25,1.562; 23 0.75,1.562; 24 0.25,1.562; 25 -0.25,1.562; 26 -0.75,1.562; 27 -1.25,1.562; 28 -1.75,1.562 | smd 0.425 x 0.3: 2 -2.312,0.75; 3 -2.312,0.25; 4 -2.312,-0.25; 5 -2.312,-0.75; 16 2.312,-0.75; 17 2.312,-0.25; 18 2.312,0.25; 19 2.312,0.75
SOIC8 = smd 0.6 x 2.2: 1 -1.905,-2.6; 2 -0.635,-2.6; 3 0.635,-2.6; 4 1.905,-2.6; 5 1.905,2.6; 6 0.635,2.6; 7 -0.635,2.6; 8 -1.905,2.6
JST-XH-02-PACKAGE-ROUND-PAD = drill 1.016: 1 -1.27,0; 2 1.27,0
AK500/2 = drill 1.321 long: 1 -2.515,0; 2 2.515,0
53398-10 = smd 0.8 x 1.8: 1 5.625,-2.5; 2 4.375,-2.5; 3 3.125,-2.5; 4 1.875,-2.5; 5 0.625,-2.5; 6 -0.625,-2.5; 7 -1.875,-2.5; 8 -3.125,-2.5; 9 -4.375,-2.5; 10 -5.625,-2.5 | smd 2.1 x 3: S1 8.125,0.625; S2 -8.125,0.625
53398-05 = smd 0.8 x 1.8: 1 2.5,-2.5; 2 1.25,-2.5; 3 0,-2.5; 4 -1.25,-2.5; 5 -2.5,-2.5 | smd 2.1 x 3: S1 5,0.625; S2 -5,0.625
CRYSTAL_8X3.8 = smd 1.3 x 1.9: P$1 -2.75,-1.6; P$2 2.75,-1.6; P$3 2.75,1.6; P$4 -2.75,1.6

### Placement (x,y rotation side)
C1  56.8,70.7 90 bottom
C2  47.9,70.7 90 bottom
C3  70.8,56.2 270 bottom
C4  38.3,54.7 180 bottom
C5  61.4,63.1 0 bottom
C6  43.6,69.1 270 bottom
C7  37.8,62 180 bottom
C8  38.7,51 0 bottom
C9  15,53.6 180 bottom
C10  16.7,13.8 180 top
C11  14.9,35.2 0 top
C12  51.6,34.6 0 top
C13  51.6,44.2 0 top
C14  34.5,39.2 270 bottom
C15  47.1,36.6 270 top
C16  75.5,68.1 90 bottom
D1  58,18.7 180 top
D2  58,26.7 0 top
D3  58,15.5 180 top
D4  58,23.6 0 top
JP1  42.9,77.1 0 top
LED1  49.8,46.6 0 top
LED3  9.9,33.8 270 top
R1  66.3,54.3 90 top
R2  21.2,50.1 270 top
R3  21.2,55.8 270 top
R4  54.9,46.6 180 top
R6  16,42.2 0 top
R7  16,39.5 0 top
R8  9.6,63.2 0 top
R9  9.5,67.3 180 bottom
R10  15,67.3 180 top
R11  16,45.9 180 bottom
R12  16,48.9 180 bottom
R13  15,63.2 0 bottom
R18  29.2,12.2 0 bottom
R19  7.6,34 270 top
R20  38.1,36.5 90 top
R21  42.2,36.5 90 bottom
R22  47.2,42.5 270 top
R23  43.3,48.4 0 bottom
R24  38.1,42.5 270 top
R25  38,47.8 0 top
R28  71.9,74.5 0 bottom
R29  7.7,53.4 270 bottom
R30  7.7,58.8 270 bottom
S1  70.8,56.2 270 top
SJ1  31,53.2 0 top
SJ2  20.1,68.5 0 top
SJ3  31,50.9 0 top
SJ4  20.1,71.2 0 top
SJ5  34,43.6 270 top
SJ6  34,46.4 90 top
SJ7  29.6,12.1 180 top
U1  49.9,57.1 180 top
U2  14.9,58.5 0 bottom
U3  31.2,66.2 90 top
U4  23.5,24.7 90 bottom
U5  43,43 90 bottom
U$1  71.6,68.1 0 bottom
X1  77.6,21.2 270 top
X2  43.5,10.6 180 bottom
X3  78.2,50.6 270 top
X5  7.8,44 270 bottom
Y1  52.4,69.4 270 top
Y2  53,39.7 180 bottom

### Tracks (layer width: path | path; a pad name or v marks a point on that pad's centre or on a via)
+3V3  (via drill 0.35, 0.4)
  Top 0.305: U1.19 42.85,59.85 v42.4,59.4 | U1.32 42.65,53.35 v42.3,53 | U1.48 53.65,50.15 v54.1,49.7 | U1.64 56.45,60.85 v58.1,62.5 | U1.13 47.65,64.15 v47.2,64.6 | v13.6,65.8 13.6,67.28 | 13.6,67.28 R10.2 | R2.2 21.2,45.98 R6.2 | R6.2 R7.2 | v17.4,44.2 17.4,42.22 R6.2 | 15.2,77.1 13.6,75.5 v13.6,73.2 13.6,67.28 | U3.16 21.81,66.7 v18.7,66.7 | v72.5,63.7 v74.3,63.7 | R22.2 47.1,40.98 47.1,38.2 | 47.1,38.2 C15.1 47.05,38.05 | 47.1,38.2 46.7,38.6 v44.1,38.6 42.4,38.6 39.92,41.08 38.3,41.08 | 38.3,41.08 R24.2 | SJ5.2 34.8,43 v36.1,44.3 36.1,43.28 38.3,41.08 | v81.53,67.9 81.6,67.83 81.6,67.8 | U1.1 53.65,63.85 v54.4,64.6 | v42.2,63.49 v40.91,62.2 v40.9,62.2 | v43.61,46.91 44.13,46.4 v45.1,46.4
  Top 0.508: 30.2,77.1 JP1.12 34.6,81.5 76.1,81.5 81.6,76 81.6,67.8 81.6,46.4 | 30.2,77.1 15.2,77.1 9.6,77.1 4.4,71.9 4.4,53.5 v5.9,52 | X3.1 80.17,44.98 81.6,46.4 | 81.6,46.4 81.6,41.6 78.05,38.05 47.05,38.05 | JP1.11 30.2,77.1
  Bottom 0.152: 41.88,49.22 R23.2
  Bottom 0.305: U5.28 43.45,41.25 43.25,41.05 U5.3 U5.4 42.75,39.95 v44.1,38.6 | U2.8 13.58,61.55 R13.2 13.58,65.78 v13.6,65.8 | R29.2 7.98,51.7 11.7,51.7 C9.1 17.42,49.78 R12.2 R11.2 17.42,44.22 v17.4,44.2 | v18.7,66.7 17.1,68.3 17.1,69.7 v13.6,73.2 | 41.88,49.22 C8.1 40.1,51.7 41.4,53 | U$1.3 70.97,64.33 71.6,63.7 v72.5,63.7 | v74.3,63.7 74.9,63.7 75.5,64.3 C16.1 80.33,66.7 v81.53,67.9 | v36.1,44.3 36.1,45.2 36.7,45.8 39.28,45.8 R23.2 42.18,48.4 43.38,47.19 43.38,47.14 v43.61,46.91 | v47.2,64.6 44.1,67.7 C6.2 38.8,67.7 31.47,75.03 JP1.11 | C4.2 41.4,53 | 41.4,53 v42.3,53 | C5.2 58.7,63.1 v58.1,62.5 56,64.6 v54.4,64.6 v47.2,64.6 | v42.4,59.4 41.8,59.4 C7.2 39.4,62.2 v40.9,62.2 | v47.2,64.6 45.31,64.6 45.12,64.78 43.49,64.78 v42.2,63.49 | v45.1,46.4 50.8,46.4 v54.1,49.7
  Bottom 0.508: v5.9,52 7.68,52 R29.2
+5V
  Top 0.508: LED3.A 10.92,34.2 11.7,34.2 12.36,34.86 C11.1
  Bottom 0.305: U4.12 19.05,32.34 18.1,33.3 14.26,33.3 12.43,35.13 C11.1
  Bottom 0.508: JP1.9 27.66,77.1 | 12.43,35.13 7.37,35.13 4.4,38.1 4.4,71.9 9.6,77.1 27.66,77.1 | JP1.10 27.66,77.1
A1  (via drill 0.35)
  Top 0.152: v12.3,39.5 R7.1
  Bottom 0.152: X5.1 v12.3,39.5
A2
  Bottom 0.152: X5.3 12.68,44 R11.1
BAT+
  Top 0.813: D3.C D1.C 64.31,19.93 X1.2 69.67,12 52.7,12 49.3,15.4 38.4,15.4 36.8,13.8 C10.1
  Bottom 0.813: U4.6 22.86,16.27 20.4,13.8 C10.1
BAT-  (via drill 0.5)
  Top 0.813: X1.1 64.21,22.47 D4.A D2.A | v31.7,12.2 30.3,12.2 SJ7.1
  Bottom 0.508: 13.5,19.5 13.5,14.46 C10.2
  Bottom 0.61: U4.20 32.4,31.4 33.4,30.4 33.4,19.3 32.1,18 U4.1 | U4.11 14.9,31.4 13.75,30.25 | 13.75,30.25 13.5,30 13.5,19.5 15,18 U4.10 | 13.75,30.25 15.1,28.9 32.3,28.9 33.6,30.2
  Bottom 0.813: X1.1 69.87,30.2 33.6,30.2 32.4,31.4 | R18.1 33.4,12.2 | 32.1,18 33.4,16.7 33.4,12.2 | 33.4,12.2 v31.7,12.2
BOOT  (via drill 0.35)
  Top 0.152: U1.60 56.45,58.85 v58.2,57.1 | X3.8 75.08,53.73 73,55.8 66.22,55.8 | v59.5,55.8 66.22,55.8 | 66.22,55.8 R1.2
  Bottom 0.152: v58.2,57.1 v59.5,55.8
C1  (via drill 0.35)
  Top 0.152: v12.1,41.7 14.08,41.7 R6.1 15.6,43.22 15.6,44 15.61,44.01 v15.61,55.4
  Bottom 0.152: X5.2 11.05,42.75 v12.1,41.7 | v15.61,55.4 15.61,58.21 16.54,59.13 U2.2
C2  (via drill 0.4)
  Top 0.152: v12.32,51.18 10.2,53.3 v10.2,57.4
  Bottom 0.152: X5.4 11.25,45.25 12.2,46.2 12.2,47.5 13.6,48.9 R12.1 12.3,51.18 12.3,51.2 v12.32,51.18 | v10.2,57.4 10.66,57.87 U2.6
CAN_H
  Bottom 0.152: U$1.7 72.23,72.03 73.32,73.12 73.32,74.3 R28.1 73.32,77.18 71.04,79.46 38.64,79.46 37.55,78.37 JP1.16
CAN_L
  Bottom 0.152: R28.2 70.69,74.29 | 70.69,74.29 70.97,74.01 U$1.6 | JP1.18 40.36,77.1 69.2,77.1 70.69,75.61 70.69,74.29
CAN_RX  (via drill 0.35)
  Top 0.152: U1.44 51.65,50.55 50.89,49.79 50.89,49.03 51.53,48.39 64.01,48.39 65,47.4 v67.59,47.4 v67.6,47.39
  Bottom 0.152: v67.6,47.39 72.6,52.39 72.6,61.3 69.69,64.2 U$1.4
CAN_TX  (via drill 0.35)
  Top 0.152: U1.45 52.15,50.45 51.3,49.6 51.3,49.2 51.69,48.81 64.29,48.81 65,48.1 v69.39,48.1 v69.4,48.09
  Bottom 0.152: U$1.1 73.5,52.3 69.4,48.2 v69.4,48.09
DIG10  (via drill 0.35)
  Top 0.152: U1.51 56.67,54.35 57.13,53.89 59.39,53.89 v59.9,54.4 | JP1.40 67.03,77.38 65.94,76.28 65.94,64.15 v60.3,58.51
  Bottom 0.152: v59.9,54.4 60.3,54.8 v60.3,58.51
ENA  (via drill 0.35)
  Top 0.152: U1.53 57.35,55.35 v57.5,55.2 | v17,14.5 35,32.5 v43.29,32.5 v43.3,32.49
  Bottom 0.152: U4.8 20.32,16.32 19.6,15.6 18.1,15.6 v17,14.5 | v57.5,55.2 58.1,54.6 58.1,35.2 55.39,32.49 v43.3,32.49
ENCODER_1  (via drill 0.35, 0.4)
  Top 0.152: 14.6,64.6 16.42,66.42 R10.1 17.62,68.5 SJ2.1 | 14.6,64.6 12.42,64.6 R8.2 15.22,59 v22.3,59 | 14.6,64.6 v17.6,61.6 | v28.6,53.4 30.2,53.4 SJ1.1
  Bottom 0.152: v17.6,61.6 17.6,60.64 U2.1 | v22.3,59 27.9,53.4 v28.6,53.4
ENCODER_1_COUNT
  Top 0.152: SJ2.2 23.5,68.5 | 23.5,68.5 25.4,68.5 26.12,67.78 U3.13 | U3.11 28.66,68.94 28.1,69.5 24.5,69.5 23.5,68.5
ENCODER_1_STM  (via drill 0.35)
  Top 0.152: U1.56 56.89,56.85 v57.1,57.06 | SJ1.2 33,53.2 34,52.2 v34,52.1 | v59.1,37.1 58,36 v57.2,36
  Bottom 0.152: v57.1,57.06 59.1,55.06 v59.1,37.1 | v34,52.1 34,50.2 32.1,48.3 32.1,37.1 36,33.2 54.4,33.2 v57.2,36
ENCODER_2  (via drill 0.35, 0.4)
  Top 0.152: v15.7,69.3 17.6,71.2 SJ4.1 | v28.5,51.1 30.2,51.1 SJ3.1
  Bottom 0.152: R9.2 13.7,67.3 | 13.7,67.3 16.42,64.58 R13.1 | U2.7 13.84,59.13 16.42,61.72 R13.1 | 13.7,67.3 v15.7,69.3 | R13.1 17.02,62.6 17.8,62.6 21.5,58.9 21.5,58.1 v28.5,51.1
ENCODER_2_COUNT
  Top 0.152: SJ4.2 28.6,71.2 29.93,69.87 U3.10
ENCODER_2_STM  (via drill 0.35)
  Top 0.152: U1.35 47.15,50.45 47.6,50 47.6,49.1 47.25,48.75 v47.1,48.75 | v43.4,51 31.7,51 SJ3.2
  Bottom 0.152: v47.1,48.75 46.65,48.75 45.9,49.5 45.9,49.7 45.91,49.71 45.91,50.29 45.9,50.3 45.9,50.7 45.6,51 v43.4,51
GND  (via drill 0.35)
  Top 0.152: R1.1 67.57,52.88 v67.89,53.2
  Top 0.305: U1.18 42.35,60.35 v41.7,61 | U1.31 42.65,53.85 v42.3,54.2 | U1.47 53.15,50.15 v52.7,49.7 | U1.12 48.15,65.15 v47.9,65.4 | SJ6.2 34.8,47.8 R25.1 | v57.5,60.3 57.45,60.35 U1.63
  Bottom 0.152: v67.89,53.2 69.5,54.81 69.5,56.5 70.6,57.6 C3.1
  Bottom 0.305: U5.15 42.19,45.25 U5.16 42.25,43.15 | U5.10 41.85,42.75 42.25,43.15 | U5.25 42.65,42.75 | 42.65,42.75 42.25,43.15 | U5.18 43.25,43.35 42.65,42.75 | C11.2 19.2,35.2 20.32,34.08 U4.13 U4.14 U4.15 | U2.4 16.4,55.63 C9.2 | C16.2 75.5,70.6 75.4,70.7 U$1.8
  pour Top: 64,0 83,0 arc90 86,3 86,13.5 arc90 84.5,15 arc-90 83,16.5 83,69.5 arc-90 84.5,71 arc90 86,72.5 86,83 arc90 83,86 62.5,86 arc90 61,84.5 arc-90 59.5,83 26.5,83 arc-90 25,84.5 arc90 23.5,86 3,86 arc90 0,83 0,72.5 arc90 1.5,71 arc-90 3,69.5 3,16.5 arc-90 1.5,15 arc90 0,13.5 0,3 arc90 3,0 22,0 arc90 25,3 arc-90 28,6 58,6 arc-90 61,3 arc90
  pour Bottom: 64,0 83,0 arc90 86,3 86,13.5 arc90 84.5,15 arc-90 83,16.5 83,69.5 arc-90 84.5,71 arc90 86,72.5 86,83 arc90 83,86 62.5,86 arc90 61,84.5 arc-90 59.5,83 26.5,83 arc-90 25,84.5 arc90 23.5,86 3,86 arc90 0,83 0,72.5 arc90 1.5,71 arc-90 3,69.5 3,16.5 arc-90 1.5,15 arc90 0,13.5 0,3 arc90 3,0 22,0 arc90 25,3 arc-90 28,6 58,6 arc-90 61,3 arc90
I2C_ADDR  (via drill 0.35)
  Top 0.152: v42.6,46.87 41.67,47.8 R25.2 39.3,47.68 39.3,46.5 38.9,46.1 35.6,46.1 35.2,45.7 34,45.7
  Top 0.305: SJ6.1 34,45.7 SJ5.1
  Bottom 0.152: U5.17 42.75,46.72 v42.6,46.87
INPUT1  (via drill 0.35)
  Top 0.152: U1.61 56.55,59.35 57.8,58.1 58.5,58.1 60.7,60.3 v60.8,60.3 | v42.3,31.5 35.5,31.5 v17.7,13.7
  Bottom 0.152: U4.7 21.59,16.39 19.99,14.79 18.83,14.79 17.74,13.7 v17.7,13.7 | v60.8,60.3 61.6,59.5 61.6,37 56.1,31.5 v42.3,31.5
INPUT2  (via drill 0.35)
  Top 0.152: v16.3,15.3 24.6,23.6 v24.6,34 | U1.23 42,57.85 v41.73,57.58
  Bottom 0.152: U4.9 19.05,16.66 18.6,16.2 17.2,16.2 v16.3,15.3 | v41.73,57.58 40.35,56.2 34.9,56.2 24.6,45.9 v24.6,34
LBK  (via drill 0.35)
  Top 0.152: U1.38 48.65,48.85 49.5,48 51.35,48 51.36,47.99 63.61,47.99 64.92,46.68 67.89,46.68 67.91,46.7 72.9,46.7 v73,46.8 | v74.4,61 73.7,61.7 v71.2,61.7
  Bottom 0.152: v73,46.8 75.5,49.3 75.5,59.9 v74.4,61 | v71.2,61.7 70.3,61.7 68.7,63.3 68.7,67.1 69.69,68.09 U$1.5
MCO  (via drill 0.35)
  Top 0.152: X3.9 75.12,54.98 73,57.1 v64.91,57.1 v64.9,57.09 | U1.5 51.67,62.68 51.67,61.76 51.86,61.57 53.94,61.57 55.57,63.2 v55.6,63.2
  Bottom 0.152: v64.9,57.09 63.5,58.49 v63.5,58.51 63.5,60.6 63.45,60.65 63.4,60.7 62.5,61.6 61,61.6 57.9,61.6 56.3,63.2 v55.6,63.2
MISO
  Top 0.152: U1.10 49.15,65.73 41.98,72.9 | 41.98,72.9 | 41.98,72.9 40.68,74.2 35.64,74.2 JP1.13
MOSI  (via drill 0.35)
  Top 0.152: U1.11 48.65,65.65 41.6,72.7 40.61,73.69 v34.5,73.69
  Bottom 0.152: JP1.14 34.01,77.38 32.92,76.28 32.92,75.28 v34.5,73.69
N$1
  Top 0.152: U1.37 48.15,46.83 LED1.A
N$2
  Top 0.305: LED3.C 7.8,32.38 R19.2
N$3  (via drill 0.4)
  Top 0.152: U1.3 52.65,70.8 Y1.P$4 55.2,70.95 v55.2,70.9
  Bottom 0.152: v55.2,70.9 55.6,70.9 C1.2
N$4
  Bottom 0.152: C14.1 36.1,40.6 37,39.7 38.7,39.7 40.4,41.4 40.4,41.9 40.75,42.25 U5.9
N$8  (via drill 0.4)
  Top 0.152: U1.4 52.15,70.8 Y1.P$1 50.8,72 v49.7,70.9
  Bottom 0.152: v49.7,70.9 49.1,70.9 C2.2
N$10
  Top 0.152: LED1.C R4.2
N$15  (via drill 0.5)
  Top 0.813: v27.7,12.1 SJ7.2
  Bottom 0.508: U4.2 27.95,15.04 25.1,12.2
  Bottom 0.813: v27.7,12.1 25.2,12.1 25.1,12.2 R18.2
NRESET  (via drill 0.35)
  Top 0.152: v40.1,43.7 39.88,43.92 R24.1
  Bottom 0.152: U5.11 40.55,43.25 v40.1,43.7
NRST  (via drill 0.35)
  Top 0.152: S1.2 70.78,53.02 | 70.78,53.02 69.75,52 v69,52 | X3.7 74.53,52.48 73.97,53.02 70.78,53.02 | U1.7 50.67,62.68 50.67,61.76 51.27,61.16 54.14,61.16 54.88,61.9 v55.8,61.9
  Bottom 0.152: C3.2 70.1,54.8 68.6,53.3 68.6,52.4 v69,52 66.2,52 62.8,55.4 62.8,58.21 62.79,58.22 62.79,58.8 62.8,58.81 62.8,59.3 61.09,61.01 57.59,61.01 56.7,61.9 v55.8,61.9
OUT1  (via drill 0.5)
  Top 0.813: D1.A 35.3,18.7 32.1,15.5 v26.8,15.5
  Bottom 0.813: D2.C 56.2,26.7 58,24.9 58,20.1 56.6,18.7 D1.A 49.2,18.7 46.02,15.52 X2.2 | U4.4 25.41,16.89 v26.8,15.5
OUT2
  Top 0.813: D4.C 55.6,23.6 58,21.2 58,17.2 56.3,15.5 D3.A
  Bottom 0.813: D4.C 48.4,23.6 40.98,16.18 | 40.98,16.18 X2.1 | 40.98,16.18 36.8,12 36.8,8.6 36,7.8 21.1,7.8 19.5,9.4 19.5,11.1 24.1,15.7 24.1,17.96 U4.5
PS0  (via drill 0.35)
  Top 0.152: R20.2 39.98,39.8 v40,39.8
  Bottom 0.152: v40,39.8 40.95,40.75 U5.6
PS1
  Bottom 0.152: U5.5 42.25,37.97 R21.2
QA
  Top 0.152: U1.21 42.85,58.85 42.69,58.69 41.31,58.69 40.1,59.9 27.1,59.9 26.96,60.04 26.95,60.04 26.75,60.23 26.75,62.56 26.56,62.76 25.74,62.76 23.58,64.92 U3.15
QB  (via drill 0.35)
  Top 0.152: U1.22 42.93,58.35 42.86,58.28 35.81,58.28 34.6,59.49 32.8,59.49 32.5,59.19 v29.9,59.19 | U3.1 22.31,59.99 22.59,59.71 25.4,56.9 v27.6,56.9
  Bottom 0.152: v29.9,59.19 v29.89,59.19 v27.6,56.9
QC
  Top 0.152: U1.25 41.45,56.85 40.42,57.88 25.22,57.88 25,58.1 24.95,58.15 23.58,59.52 U3.2
QD  (via drill 0.35)
  Top 0.152: U1.26 41.38,56.35 40.56,57.16 v34.34,57.16 | U3.3 24.85,59.35 25.9,58.3 30.01,58.3 30.3,58.59 v32.9,58.59
  Bottom 0.152: v34.34,57.16 32.91,58.59 v32.9,58.59
QE  (via drill 0.35)
  Top 0.152: U3.4 26.12,59.48 v26.59,59.01 v26.6,59.01 | v26.6,56.09 33.19,56.09 33.2,56.1 40,56.1 40.25,55.85 U1.27
  Bottom 0.152: v26.6,59.01 v26.6,56.09
SCL  (via drill 0.35)
  Top 0.152: U1.29 43.25,54.85 43,55.1 41.6,55.1 41.2,54.7 41.2,52.5 41.7,52 43.8,52 45.2,50.6 v45.2,50
  Bottom 0.152: U5.19 43.75,46.05 45.02,47.32 45.02,48.3 | R23.1 44.72,48 45.02,48.3 | v45.2,50 45.2,48.48 45.02,48.3
SCLK  (via drill 0.35)
  Top 0.152: v35.6,72.1 v34.4,70.9 | U1.34 46.65,49.76 v46.71,49.76
  Bottom 0.152: JP1.15 36.55,73.05 v35.6,72.1 | v34.4,70.9 36.55,68.75 36.55,67.75 42.71,61.59 46.71,57.59 v46.71,49.76
SDA  (via drill 0.35)
  Top 0.152: R22.1 47.2,45.2 46.8,45.6 v46,45.6 46,50.23 45.67,50.56 45.67,53.9 45.23,54.33 44.32,54.33 U1.30
  Bottom 0.152: U5.20 44.91,45.6 v46,45.6
SPI2_NSS
  Top 0.152: U1.62 56.65,59.85 57.5,59 58.5,59 58.8,59.3 58.8,61 58.8,61.1 58.8,62.2 63.4,66.8 63.4,75.38 63.4,77.28 JP1.38
SWCLK
  Top 0.152: X3.5 74.12,49.98 72.8,51.3 69.3,51.3 69.29,51.29 68.71,51.29 68.7,51.3 65.5,51.3 63.5,53.3 55.55,53.3 U1.49
SWDIO  (via drill 0.35)
  Top 0.152: X3.6 74.12,51.23 v74.1,51.2 | v71.6,48.8 65.2,48.8 64.5,49.5 56.7,49.5 56.69,49.49 56.11,49.49 54.4,51.2 54.4,52.3 53.7,53 53.1,53 52.65,52.55 U1.46
  Bottom 0.152: v74.1,51.2 71.7,48.8 v71.6,48.8
SWO
  Top 0.152: X3.10 74.97,56.23 73.4,57.8 60.5,57.8 58.6,55.9 57.8,55.9 57.79,55.91 57.49,55.91 57.1,56.3 57.05,56.35 U1.55
U_RX  (via drill 0.35)
  Top 0.152: U1.17 43,62.15 v43,62.3 | X3.3 74.12,47.48 71.8,49.8 65,49.8 64.6,50.2 v56.4,50.2
  Bottom 0.152: v43,62.3 44.4,62.3 56.4,50.3 v56.4,50.2
U_TX  (via drill 0.35)
  Top 0.152: U1.16 44.85,64 v44.8,64 | X3.4 74.17,48.73 72.2,50.7 65.2,50.7 64.3,51.6 v56.8,51.6
  Bottom 0.152: v44.8,64 44.8,62.6 55.8,51.6 v56.8,51.6
V_REF1  (via drill 0.35)
  Top 0.152: R3.2 21.02,54.38 19.9,55.5 19.9,56.9 v19.5,57.3 13.2,57.3 8.18,62.32 R8.1
  Top 0.305: R3.2 R2.1
  Bottom 0.152: U2.3 18.93,57.87 v19.5,57.3
V_REF2
  Bottom 0.152: U2.5 8.48,56.59 R30.2 | R9.1 6.1,65.32 6.1,58.6 7.7,57
  Bottom 0.305: R30.2 7.7,57 R29.1
XIN32  (via drill 0.4)
  Top 0.152: v51.3,36.7 51.3,35.7 C12.1
  Bottom 0.152: U5.27 46.6,41.75 Y2.P$4 51.3,37.05 v51.3,36.7
XOUT32  (via drill 0.4)
  Top 0.152: v51.4,42.7 51.4,43 C13.1
  Bottom 0.152: U5.26 49.3,42.25 Y2.P$1 51.4,42.45 v51.4,42.7
~COUNT_ENABLE
  Top 0.152: U1.52 55.48,54.87 52.56,54.87 43.23,64.2 28.86,64.2 27.39,65.67 U3.12

### Text on the board
tNames: Zenith Aerospace - 2019 | Alves_ADC v.1.0